# EAGLE board UCirKitBreadboardWithEverythingBottom-08201626 (EAGLE 6.5.0), part 1 of 3
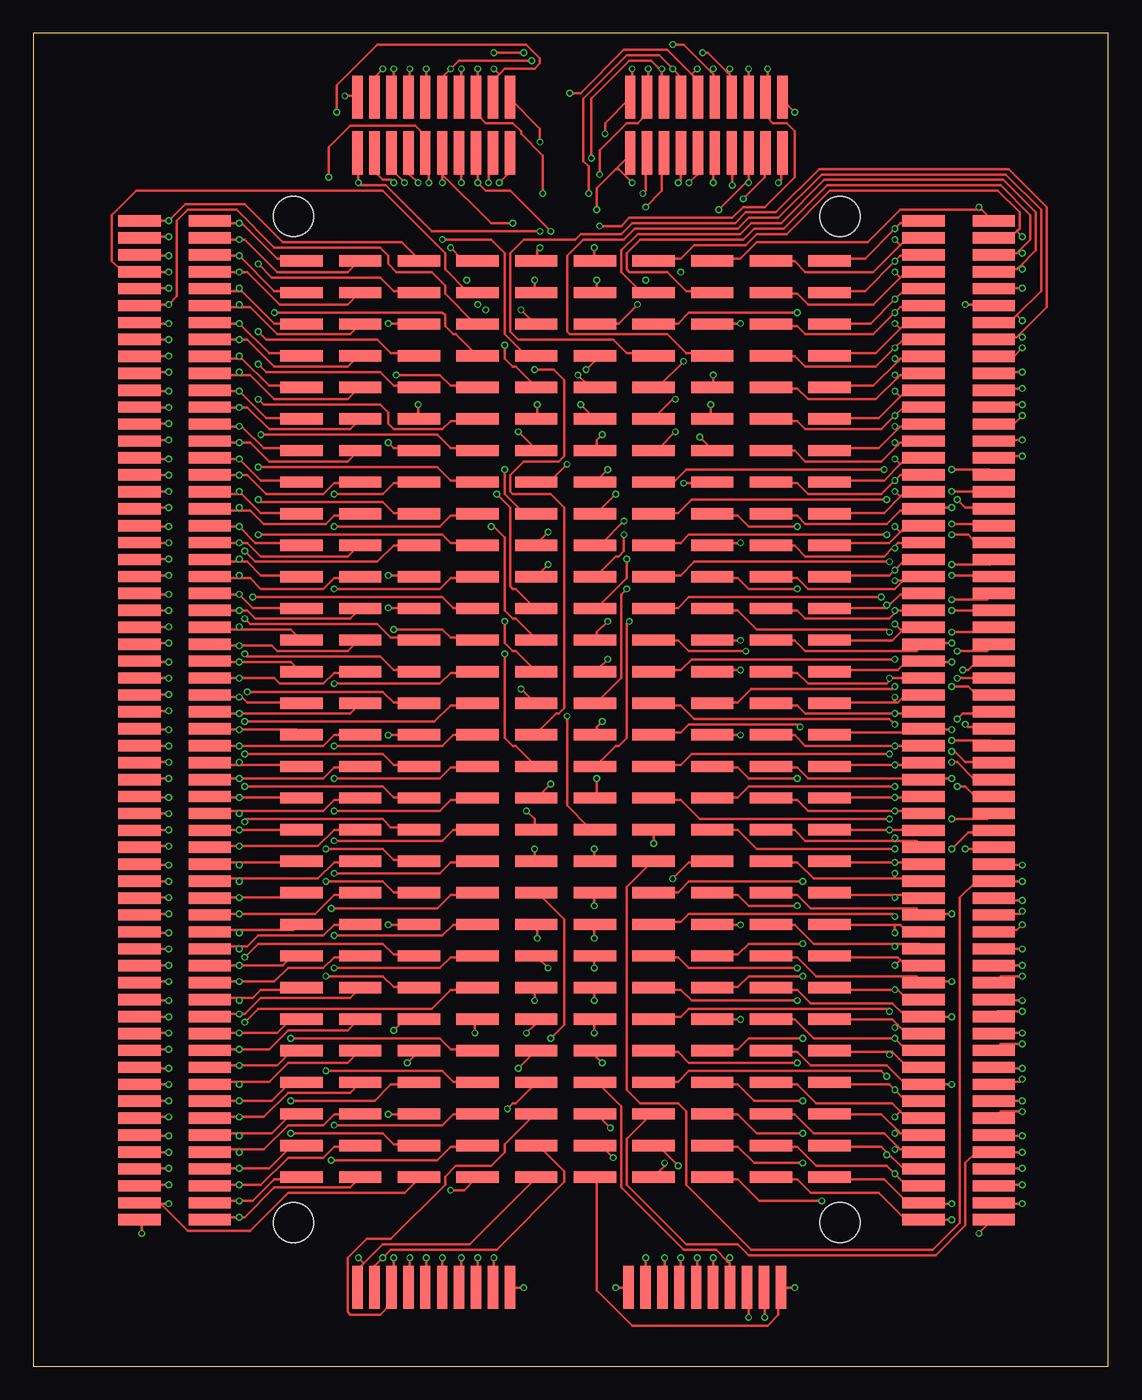
[diagram p5: board, top side]
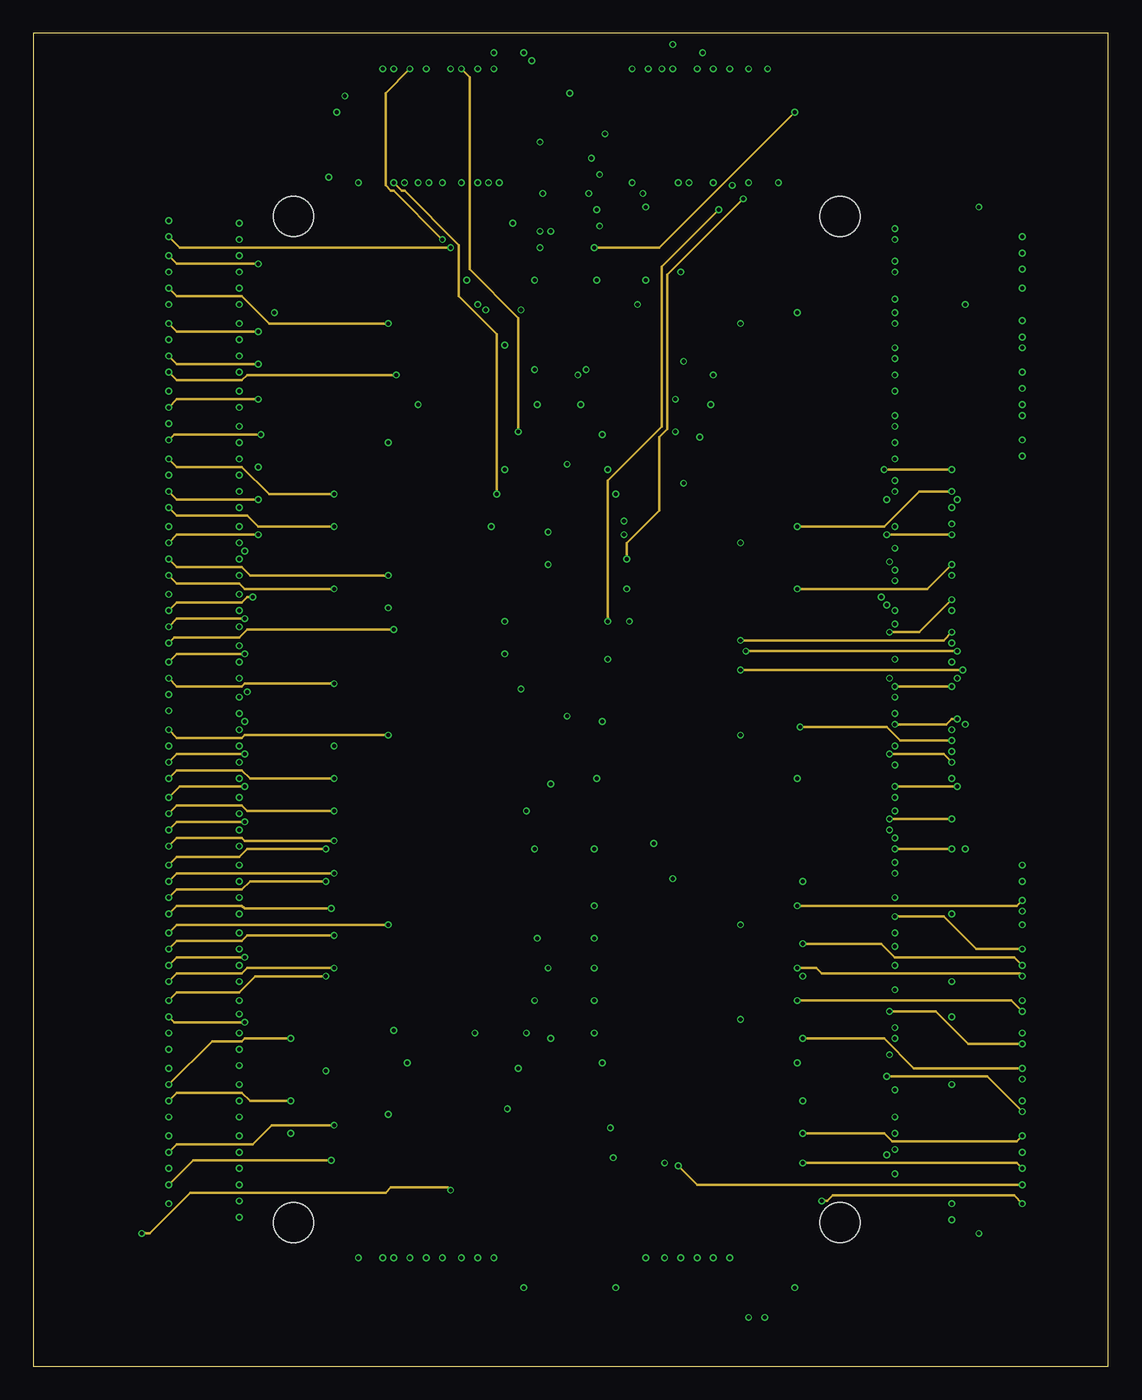
[diagram p6: board, inner layer Route2]
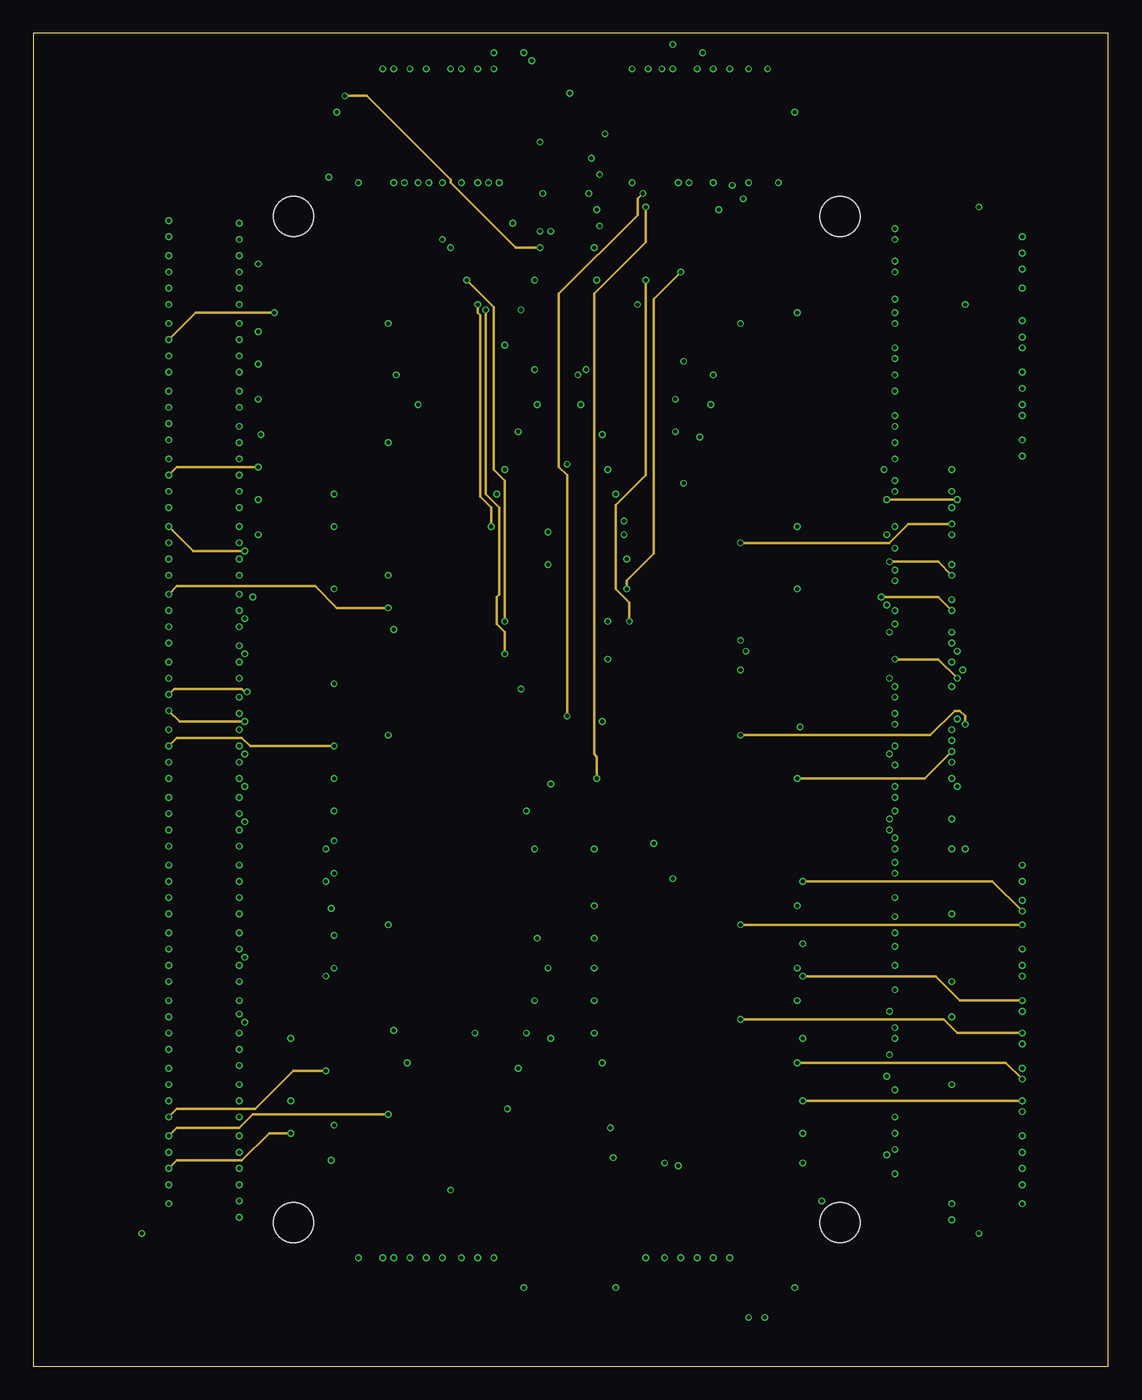
[diagram p7: board, inner layer Route15]
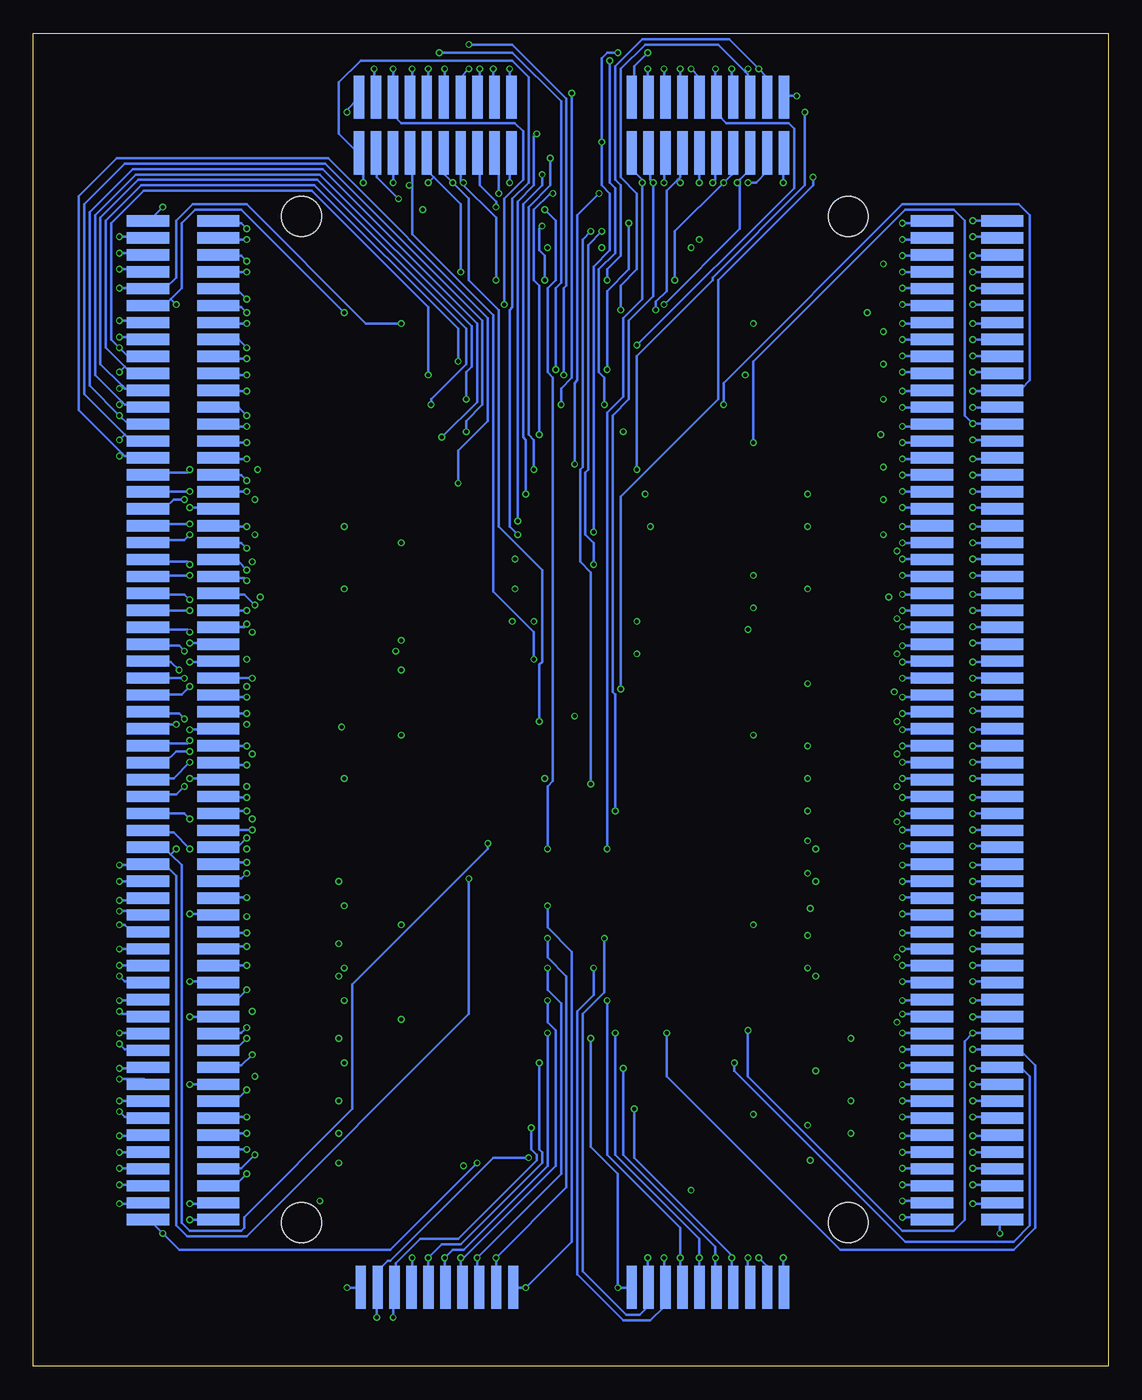
[diagram p8: board, bottom side, seen from below]

Size 80.62 x 100 mm. Coordinates in mm from the lower left corner, seen from the top.
Outline: 0,0 80.62,0 80.62,100 0,100 0,0
Copper layers (1*2*15*16): Top 0.035mm / dielectric 0.2mm / Route2 0.0175mm / dielectric 0.3mm / Route15 0.0175mm / dielectric 0.2mm / Bottom 0.035mm
Design rules "SeeedStudio_4layer_DRU_no_angle_20140221": minimum track width 8mil, minimum drill 12mil, track to track 8mil, track to pad 8mil, pad to pad 8mil, via to via 8mil, smd to smd 0mil, copper to edge 10mil, drill to drill 8mil, minimum pad ring 6mil, minimum via ring 4mil, stop-mask expansion 4mil, vias tented up to drill 100mil, thermal gap 10mil
Holes 3 mm at 19.51,86.27 19.51,10.77 60.51,10.77 60.51,86.27

## Footprints (pad centres in the part's own frame; a part is rotated, then mirrored left to right if it is on the bottom)
1X01_SMD_3.25X0.85MM_NO_SILK = smd 3.25 x 0.85: P$1 0,0

## Placement (x,y rotation side)
JP301  [1X01_SMD_3.25X0.85MM_NO_SILK]  20.11,82.92 0 top
JP302  [1X01_SMD_3.25X0.85MM_NO_SILK]  24.51,82.92 0 top
JP303  [1X01_SMD_3.25X0.85MM_NO_SILK]  28.91,82.92 0 top
JP304  [1X01_SMD_3.25X0.85MM_NO_SILK]  33.31,82.92 0 top
JP305  [1X01_SMD_3.25X0.85MM_NO_SILK]  37.71,82.92 0 top
JP306  [1X01_SMD_3.25X0.85MM_NO_SILK]  42.11,82.92 0 top
JP307  [1X01_SMD_3.25X0.85MM_NO_SILK]  46.51,82.92 0 top
JP308  [1X01_SMD_3.25X0.85MM_NO_SILK]  50.91,82.92 0 top
JP309  [1X01_SMD_3.25X0.85MM_NO_SILK]  55.31,82.92 0 top
JP310  [1X01_SMD_3.25X0.85MM_NO_SILK]  59.71,82.92 0 top
JP311  [1X01_SMD_3.25X0.85MM_NO_SILK]  20.11,80.55 0 top
JP312  [1X01_SMD_3.25X0.85MM_NO_SILK]  24.51,80.55 0 top
JP313  [1X01_SMD_3.25X0.85MM_NO_SILK]  28.91,80.55 0 top
JP314  [1X01_SMD_3.25X0.85MM_NO_SILK]  33.31,80.55 0 top
JP315  [1X01_SMD_3.25X0.85MM_NO_SILK]  37.71,80.55 0 top
JP316  [1X01_SMD_3.25X0.85MM_NO_SILK]  42.11,80.55 0 top
JP317  [1X01_SMD_3.25X0.85MM_NO_SILK]  46.51,80.55 0 top
JP318  [1X01_SMD_3.25X0.85MM_NO_SILK]  50.91,80.55 0 top
JP319  [1X01_SMD_3.25X0.85MM_NO_SILK]  55.31,80.55 0 top
JP320  [1X01_SMD_3.25X0.85MM_NO_SILK]  59.71,80.55 0 top
JP321  [1X01_SMD_3.25X0.85MM_NO_SILK]  20.11,78.18 0 top
JP322  [1X01_SMD_3.25X0.85MM_NO_SILK]  24.51,78.18 0 top
JP323  [1X01_SMD_3.25X0.85MM_NO_SILK]  28.91,78.18 0 top
JP324  [1X01_SMD_3.25X0.85MM_NO_SILK]  33.31,78.18 0 top
JP325  [1X01_SMD_3.25X0.85MM_NO_SILK]  37.71,78.18 0 top
JP326  [1X01_SMD_3.25X0.85MM_NO_SILK]  42.11,78.18 0 top
JP327  [1X01_SMD_3.25X0.85MM_NO_SILK]  46.51,78.18 0 top
JP328  [1X01_SMD_3.25X0.85MM_NO_SILK]  50.91,78.18 0 top
JP329  [1X01_SMD_3.25X0.85MM_NO_SILK]  55.31,78.18 0 top
JP330  [1X01_SMD_3.25X0.85MM_NO_SILK]  59.71,78.18 0 top
JP331  [1X01_SMD_3.25X0.85MM_NO_SILK]  20.11,75.81 0 top
JP332  [1X01_SMD_3.25X0.85MM_NO_SILK]  24.51,75.81 0 top
JP333  [1X01_SMD_3.25X0.85MM_NO_SILK]  28.91,75.81 0 top
JP334  [1X01_SMD_3.25X0.85MM_NO_SILK]  33.31,75.81 0 top
JP335  [1X01_SMD_3.25X0.85MM_NO_SILK]  37.71,75.81 0 top
JP336  [1X01_SMD_3.25X0.85MM_NO_SILK]  42.11,75.81 0 top
JP337  [1X01_SMD_3.25X0.85MM_NO_SILK]  46.51,75.81 0 top
JP338  [1X01_SMD_3.25X0.85MM_NO_SILK]  50.91,75.81 0 top
JP339  [1X01_SMD_3.25X0.85MM_NO_SILK]  55.31,75.81 0 top
JP340  [1X01_SMD_3.25X0.85MM_NO_SILK]  59.71,75.81 0 top
JP341  [1X01_SMD_3.25X0.85MM_NO_SILK]  20.11,73.44 0 top
JP342  [1X01_SMD_3.25X0.85MM_NO_SILK]  24.51,73.44 0 top
JP343  [1X01_SMD_3.25X0.85MM_NO_SILK]  28.91,73.44 0 top
JP344  [1X01_SMD_3.25X0.85MM_NO_SILK]  33.31,73.44 0 top
JP345  [1X01_SMD_3.25X0.85MM_NO_SILK]  37.71,73.44 0 top
JP346  [1X01_SMD_3.25X0.85MM_NO_SILK]  42.11,73.44 0 top
JP347  [1X01_SMD_3.25X0.85MM_NO_SILK]  46.51,73.44 0 top
JP348  [1X01_SMD_3.25X0.85MM_NO_SILK]  50.91,73.44 0 top
JP349  [1X01_SMD_3.25X0.85MM_NO_SILK]  55.31,73.44 0 top
JP350  [1X01_SMD_3.25X0.85MM_NO_SILK]  59.71,73.44 0 top
JP351  [1X01_SMD_3.25X0.85MM_NO_SILK]  20.11,71.07 0 top
JP352  [1X01_SMD_3.25X0.85MM_NO_SILK]  24.51,71.07 0 top
JP353  [1X01_SMD_3.25X0.85MM_NO_SILK]  28.91,71.07 0 top
JP354  [1X01_SMD_3.25X0.85MM_NO_SILK]  33.31,71.07 0 top
JP355  [1X01_SMD_3.25X0.85MM_NO_SILK]  37.71,71.07 0 top
JP356  [1X01_SMD_3.25X0.85MM_NO_SILK]  42.11,71.07 0 top
JP357  [1X01_SMD_3.25X0.85MM_NO_SILK]  46.51,71.07 0 top
JP358  [1X01_SMD_3.25X0.85MM_NO_SILK]  50.91,71.07 0 top
JP359  [1X01_SMD_3.25X0.85MM_NO_SILK]  55.31,71.07 0 top
JP360  [1X01_SMD_3.25X0.85MM_NO_SILK]  59.71,71.07 0 top
JP361  [1X01_SMD_3.25X0.85MM_NO_SILK]  20.11,68.7 0 top
JP362  [1X01_SMD_3.25X0.85MM_NO_SILK]  24.51,68.7 0 top
JP363  [1X01_SMD_3.25X0.85MM_NO_SILK]  28.91,68.7 0 top
JP364  [1X01_SMD_3.25X0.85MM_NO_SILK]  33.31,68.7 0 top
JP365  [1X01_SMD_3.25X0.85MM_NO_SILK]  37.71,68.7 0 top
JP366  [1X01_SMD_3.25X0.85MM_NO_SILK]  42.11,68.7 0 top
JP367  [1X01_SMD_3.25X0.85MM_NO_SILK]  46.51,68.7 0 top
JP368  [1X01_SMD_3.25X0.85MM_NO_SILK]  50.91,68.7 0 top
JP369  [1X01_SMD_3.25X0.85MM_NO_SILK]  55.31,68.7 0 top
JP370  [1X01_SMD_3.25X0.85MM_NO_SILK]  59.71,68.7 0 top
JP371  [1X01_SMD_3.25X0.85MM_NO_SILK]  20.11,66.33 0 top
JP372  [1X01_SMD_3.25X0.85MM_NO_SILK]  24.51,66.33 0 top
JP373  [1X01_SMD_3.25X0.85MM_NO_SILK]  28.91,66.33 0 top
JP374  [1X01_SMD_3.25X0.85MM_NO_SILK]  33.31,66.33 0 top
JP375  [1X01_SMD_3.25X0.85MM_NO_SILK]  37.71,66.33 0 top
JP376  [1X01_SMD_3.25X0.85MM_NO_SILK]  42.11,66.33 0 top
JP377  [1X01_SMD_3.25X0.85MM_NO_SILK]  46.51,66.33 0 top
JP378  [1X01_SMD_3.25X0.85MM_NO_SILK]  50.91,66.33 0 top
JP379  [1X01_SMD_3.25X0.85MM_NO_SILK]  55.31,66.33 0 top
JP380  [1X01_SMD_3.25X0.85MM_NO_SILK]  59.71,66.33 0 top
JP381  [1X01_SMD_3.25X0.85MM_NO_SILK]  20.11,63.96 0 top
JP382  [1X01_SMD_3.25X0.85MM_NO_SILK]  24.51,63.96 0 top
JP383  [1X01_SMD_3.25X0.85MM_NO_SILK]  28.91,63.96 0 top
JP384  [1X01_SMD_3.25X0.85MM_NO_SILK]  33.31,63.96 0 top
JP385  [1X01_SMD_3.25X0.85MM_NO_SILK]  37.71,63.96 0 top
JP386  [1X01_SMD_3.25X0.85MM_NO_SILK]  42.11,63.96 0 top
JP387  [1X01_SMD_3.25X0.85MM_NO_SILK]  46.51,63.96 0 top
JP388  [1X01_SMD_3.25X0.85MM_NO_SILK]  50.91,63.96 0 top
JP389  [1X01_SMD_3.25X0.85MM_NO_SILK]  55.31,63.96 0 top
JP390  [1X01_SMD_3.25X0.85MM_NO_SILK]  59.71,63.96 0 top
JP391  [1X01_SMD_3.25X0.85MM_NO_SILK]  20.11,61.59 0 top
JP392  [1X01_SMD_3.25X0.85MM_NO_SILK]  24.51,61.59 0 top
JP393  [1X01_SMD_3.25X0.85MM_NO_SILK]  28.91,61.59 0 top
JP394  [1X01_SMD_3.25X0.85MM_NO_SILK]  33.31,61.59 0 top
JP395  [1X01_SMD_3.25X0.85MM_NO_SILK]  37.71,61.59 0 top
JP396  [1X01_SMD_3.25X0.85MM_NO_SILK]  42.11,61.59 0 top
JP397  [1X01_SMD_3.25X0.85MM_NO_SILK]  46.51,61.59 0 top
JP398  [1X01_SMD_3.25X0.85MM_NO_SILK]  50.91,61.59 0 top
JP399  [1X01_SMD_3.25X0.85MM_NO_SILK]  55.31,61.59 0 top
JP400  [1X01_SMD_3.25X0.85MM_NO_SILK]  59.71,61.59 0 top
JP401  [1X01_SMD_3.25X0.85MM_NO_SILK]  20.11,59.22 0 top
JP402  [1X01_SMD_3.25X0.85MM_NO_SILK]  24.51,59.22 0 top
JP403  [1X01_SMD_3.25X0.85MM_NO_SILK]  28.91,59.22 0 top
JP404  [1X01_SMD_3.25X0.85MM_NO_SILK]  33.31,59.22 0 top
JP405  [1X01_SMD_3.25X0.85MM_NO_SILK]  37.71,59.22 0 top
JP406  [1X01_SMD_3.25X0.85MM_NO_SILK]  42.11,59.22 0 top
JP407  [1X01_SMD_3.25X0.85MM_NO_SILK]  46.51,59.22 0 top
JP408  [1X01_SMD_3.25X0.85MM_NO_SILK]  50.91,59.22 0 top
JP409  [1X01_SMD_3.25X0.85MM_NO_SILK]  55.31,59.22 0 top
JP410  [1X01_SMD_3.25X0.85MM_NO_SILK]  59.71,59.22 0 top
JP411  [1X01_SMD_3.25X0.85MM_NO_SILK]  20.11,56.85 0 top
JP412  [1X01_SMD_3.25X0.85MM_NO_SILK]  24.51,56.85 0 top
JP413  [1X01_SMD_3.25X0.85MM_NO_SILK]  28.91,56.85 0 top
JP414  [1X01_SMD_3.25X0.85MM_NO_SILK]  33.31,56.85 0 top
JP415  [1X01_SMD_3.25X0.85MM_NO_SILK]  37.71,56.85 0 top
JP416  [1X01_SMD_3.25X0.85MM_NO_SILK]  42.11,56.85 0 top
JP417  [1X01_SMD_3.25X0.85MM_NO_SILK]  46.51,56.85 0 top
JP418  [1X01_SMD_3.25X0.85MM_NO_SILK]  50.91,56.85 0 top
JP419  [1X01_SMD_3.25X0.85MM_NO_SILK]  55.31,56.85 0 top
JP420  [1X01_SMD_3.25X0.85MM_NO_SILK]  59.71,56.85 0 top
JP421  [1X01_SMD_3.25X0.85MM_NO_SILK]  20.11,54.48 0 top
JP422  [1X01_SMD_3.25X0.85MM_NO_SILK]  24.51,54.48 0 top
JP423  [1X01_SMD_3.25X0.85MM_NO_SILK]  28.91,54.48 0 top
JP424  [1X01_SMD_3.25X0.85MM_NO_SILK]  33.31,54.48 0 top
JP425  [1X01_SMD_3.25X0.85MM_NO_SILK]  37.71,54.48 0 top
JP426  [1X01_SMD_3.25X0.85MM_NO_SILK]  42.11,54.48 0 top
JP427  [1X01_SMD_3.25X0.85MM_NO_SILK]  46.51,54.48 0 top
JP428  [1X01_SMD_3.25X0.85MM_NO_SILK]  50.91,54.48 0 top
JP429  [1X01_SMD_3.25X0.85MM_NO_SILK]  55.31,54.48 0 top
JP430  [1X01_SMD_3.25X0.85MM_NO_SILK]  59.71,54.48 0 top
JP431  [1X01_SMD_3.25X0.85MM_NO_SILK]  20.11,52.11 0 top
JP432  [1X01_SMD_3.25X0.85MM_NO_SILK]  24.51,52.11 0 top
JP433  [1X01_SMD_3.25X0.85MM_NO_SILK]  28.91,52.11 0 top
JP434  [1X01_SMD_3.25X0.85MM_NO_SILK]  33.31,52.11 0 top
JP435  [1X01_SMD_3.25X0.85MM_NO_SILK]  37.71,52.11 0 top
JP436  [1X01_SMD_3.25X0.85MM_NO_SILK]  42.11,52.11 0 top
JP437  [1X01_SMD_3.25X0.85MM_NO_SILK]  46.51,52.11 0 top
JP438  [1X01_SMD_3.25X0.85MM_NO_SILK]  50.91,52.11 0 top
JP439  [1X01_SMD_3.25X0.85MM_NO_SILK]  55.31,52.11 0 top
JP440  [1X01_SMD_3.25X0.85MM_NO_SILK]  59.71,52.11 0 top
JP441  [1X01_SMD_3.25X0.85MM_NO_SILK]  20.11,49.74 0 top
JP442  [1X01_SMD_3.25X0.85MM_NO_SILK]  24.51,49.74 0 top
JP443  [1X01_SMD_3.25X0.85MM_NO_SILK]  28.91,49.74 0 top
JP444  [1X01_SMD_3.25X0.85MM_NO_SILK]  33.31,49.74 0 top
JP445  [1X01_SMD_3.25X0.85MM_NO_SILK]  37.71,49.74 0 top
JP446  [1X01_SMD_3.25X0.85MM_NO_SILK]  42.11,49.74 0 top
JP447  [1X01_SMD_3.25X0.85MM_NO_SILK]  46.51,49.74 0 top
JP448  [1X01_SMD_3.25X0.85MM_NO_SILK]  50.91,49.74 0 top
JP449  [1X01_SMD_3.25X0.85MM_NO_SILK]  55.31,49.74 0 top
JP450  [1X01_SMD_3.25X0.85MM_NO_SILK]  59.71,49.74 0 top
JP451  [1X01_SMD_3.25X0.85MM_NO_SILK]  20.11,47.37 0 top
JP452  [1X01_SMD_3.25X0.85MM_NO_SILK]  24.51,47.37 0 top
JP453  [1X01_SMD_3.25X0.85MM_NO_SILK]  28.91,47.37 0 top
JP454  [1X01_SMD_3.25X0.85MM_NO_SILK]  33.31,47.37 0 top
JP455  [1X01_SMD_3.25X0.85MM_NO_SILK]  37.71,47.37 0 top
JP456  [1X01_SMD_3.25X0.85MM_NO_SILK]  42.11,47.37 0 top
JP457  [1X01_SMD_3.25X0.85MM_NO_SILK]  46.51,47.37 0 top
JP458  [1X01_SMD_3.25X0.85MM_NO_SILK]  50.91,47.37 0 top
JP459  [1X01_SMD_3.25X0.85MM_NO_SILK]  55.31,47.37 0 top
JP460  [1X01_SMD_3.25X0.85MM_NO_SILK]  59.71,47.37 0 top
JP461  [1X01_SMD_3.25X0.85MM_NO_SILK]  20.11,45 0 top
JP462  [1X01_SMD_3.25X0.85MM_NO_SILK]  24.51,45 0 top
JP463  [1X01_SMD_3.25X0.85MM_NO_SILK]  28.91,45 0 top
JP464  [1X01_SMD_3.25X0.85MM_NO_SILK]  33.31,45 0 top
JP465  [1X01_SMD_3.25X0.85MM_NO_SILK]  37.71,45 0 top
JP466  [1X01_SMD_3.25X0.85MM_NO_SILK]  42.11,45 0 top
JP467  [1X01_SMD_3.25X0.85MM_NO_SILK]  46.51,45 0 top
JP468  [1X01_SMD_3.25X0.85MM_NO_SILK]  50.91,45 0 top
JP469  [1X01_SMD_3.25X0.85MM_NO_SILK]  55.31,45 0 top
JP470  [1X01_SMD_3.25X0.85MM_NO_SILK]  59.71,45 0 top
JP471  [1X01_SMD_3.25X0.85MM_NO_SILK]  20.11,42.63 0 top
JP472  [1X01_SMD_3.25X0.85MM_NO_SILK]  24.51,42.63 0 top
JP473  [1X01_SMD_3.25X0.85MM_NO_SILK]  28.91,42.63 0 top
JP474  [1X01_SMD_3.25X0.85MM_NO_SILK]  33.31,42.63 0 top
JP475  [1X01_SMD_3.25X0.85MM_NO_SILK]  37.71,42.63 0 top
JP476  [1X01_SMD_3.25X0.85MM_NO_SILK]  42.11,42.63 0 top
JP477  [1X01_SMD_3.25X0.85MM_NO_SILK]  46.51,42.63 0 top
JP478  [1X01_SMD_3.25X0.85MM_NO_SILK]  50.91,42.63 0 top
JP479  [1X01_SMD_3.25X0.85MM_NO_SILK]  55.31,42.63 0 top
JP480  [1X01_SMD_3.25X0.85MM_NO_SILK]  59.71,42.63 0 top
JP481  [1X01_SMD_3.25X0.85MM_NO_SILK]  20.11,40.26 0 top
JP482  [1X01_SMD_3.25X0.85MM_NO_SILK]  24.51,40.26 0 top
JP483  [1X01_SMD_3.25X0.85MM_NO_SILK]  28.91,40.26 0 top
JP484  [1X01_SMD_3.25X0.85MM_NO_SILK]  33.31,40.26 0 top
JP485  [1X01_SMD_3.25X0.85MM_NO_SILK]  37.71,40.26 0 top
JP486  [1X01_SMD_3.25X0.85MM_NO_SILK]  42.11,40.26 0 top
JP487  [1X01_SMD_3.25X0.85MM_NO_SILK]  46.51,40.26 0 top
JP488  [1X01_SMD_3.25X0.85MM_NO_SILK]  50.91,40.26 0 top
JP489  [1X01_SMD_3.25X0.85MM_NO_SILK]  55.31,40.26 0 top
JP490  [1X01_SMD_3.25X0.85MM_NO_SILK]  59.71,40.26 0 top
JP491  [1X01_SMD_3.25X0.85MM_NO_SILK]  20.11,37.89 0 top
JP492  [1X01_SMD_3.25X0.85MM_NO_SILK]  24.51,37.89 0 top
JP493  [1X01_SMD_3.25X0.85MM_NO_SILK]  28.91,37.89 0 top
JP494  [1X01_SMD_3.25X0.85MM_NO_SILK]  33.31,37.89 0 top
JP495  [1X01_SMD_3.25X0.85MM_NO_SILK]  37.71,37.89 0 top
JP496  [1X01_SMD_3.25X0.85MM_NO_SILK]  42.11,37.89 0 top
JP497  [1X01_SMD_3.25X0.85MM_NO_SILK]  46.51,37.89 0 top
JP498  [1X01_SMD_3.25X0.85MM_NO_SILK]  50.91,37.89 0 top
JP499  [1X01_SMD_3.25X0.85MM_NO_SILK]  55.31,37.89 0 top
JP500  [1X01_SMD_3.25X0.85MM_NO_SILK]  59.71,37.89 0 top
JP501  [1X01_SMD_3.25X0.85MM_NO_SILK]  20.11,35.52 0 top
JP502  [1X01_SMD_3.25X0.85MM_NO_SILK]  24.51,35.52 0 top
JP503  [1X01_SMD_3.25X0.85MM_NO_SILK]  28.91,35.52 0 top
JP504  [1X01_SMD_3.25X0.85MM_NO_SILK]  33.31,35.52 0 top
JP505  [1X01_SMD_3.25X0.85MM_NO_SILK]  37.71,35.52 0 top
JP506  [1X01_SMD_3.25X0.85MM_NO_SILK]  42.11,35.52 0 top
JP507  [1X01_SMD_3.25X0.85MM_NO_SILK]  46.51,35.52 0 top
JP508  [1X01_SMD_3.25X0.85MM_NO_SILK]  50.91,35.52 0 top
JP509  [1X01_SMD_3.25X0.85MM_NO_SILK]  55.31,35.52 0 top
JP510  [1X01_SMD_3.25X0.85MM_NO_SILK]  59.71,35.52 0 top
JP511  [1X01_SMD_3.25X0.85MM_NO_SILK]  20.11,33.15 0 top
JP512  [1X01_SMD_3.25X0.85MM_NO_SILK]  24.51,33.15 0 top
JP513  [1X01_SMD_3.25X0.85MM_NO_SILK]  28.91,33.15 0 top
JP514  [1X01_SMD_3.25X0.85MM_NO_SILK]  33.31,33.15 0 top
JP515  [1X01_SMD_3.25X0.85MM_NO_SILK]  37.71,33.15 0 top
JP516  [1X01_SMD_3.25X0.85MM_NO_SILK]  42.11,33.15 0 top
JP517  [1X01_SMD_3.25X0.85MM_NO_SILK]  46.51,33.15 0 top
JP518  [1X01_SMD_3.25X0.85MM_NO_SILK]  50.91,33.15 0 top
JP519  [1X01_SMD_3.25X0.85MM_NO_SILK]  55.31,33.15 0 top
JP520  [1X01_SMD_3.25X0.85MM_NO_SILK]  59.71,33.15 0 top
JP521  [1X01_SMD_3.25X0.85MM_NO_SILK]  20.11,30.78 0 top
JP522  [1X01_SMD_3.25X0.85MM_NO_SILK]  24.51,30.78 0 top
JP523  [1X01_SMD_3.25X0.85MM_NO_SILK]  28.91,30.78 0 top
JP524  [1X01_SMD_3.25X0.85MM_NO_SILK]  33.31,30.78 0 top
JP525  [1X01_SMD_3.25X0.85MM_NO_SILK]  37.71,30.78 0 top
JP526  [1X01_SMD_3.25X0.85MM_NO_SILK]  42.11,30.78 0 top
JP527  [1X01_SMD_3.25X0.85MM_NO_SILK]  46.51,30.78 0 top
JP528  [1X01_SMD_3.25X0.85MM_NO_SILK]  50.91,30.78 0 top
JP529  [1X01_SMD_3.25X0.85MM_NO_SILK]  55.31,30.78 0 top
JP530  [1X01_SMD_3.25X0.85MM_NO_SILK]  59.71,30.78 0 top
JP531  [1X01_SMD_3.25X0.85MM_NO_SILK]  20.11,28.41 0 top
JP532  [1X01_SMD_3.25X0.85MM_NO_SILK]  24.51,28.41 0 top
JP533  [1X01_SMD_3.25X0.85MM_NO_SILK]  28.91,28.41 0 top
JP534  [1X01_SMD_3.25X0.85MM_NO_SILK]  33.31,28.41 0 top
JP535  [1X01_SMD_3.25X0.85MM_NO_SILK]  37.71,28.41 0 top
JP536  [1X01_SMD_3.25X0.85MM_NO_SILK]  42.11,28.41 0 top
JP537  [1X01_SMD_3.25X0.85MM_NO_SILK]  46.51,28.41 0 top
JP538  [1X01_SMD_3.25X0.85MM_NO_SILK]  50.91,28.41 0 top
JP539  [1X01_SMD_3.25X0.85MM_NO_SILK]  55.31,28.41 0 top
JP540  [1X01_SMD_3.25X0.85MM_NO_SILK]  59.71,28.41 0 top
JP541  [1X01_SMD_3.25X0.85MM_NO_SILK]  20.11,26.04 0 top
JP542  [1X01_SMD_3.25X0.85MM_NO_SILK]  24.51,26.04 0 top
JP543  [1X01_SMD_3.25X0.85MM_NO_SILK]  28.91,26.04 0 top
JP544  [1X01_SMD_3.25X0.85MM_NO_SILK]  33.31,26.04 0 top
JP545  [1X01_SMD_3.25X0.85MM_NO_SILK]  37.71,26.04 0 top
JP546  [1X01_SMD_3.25X0.85MM_NO_SILK]  42.11,26.04 0 top
JP547  [1X01_SMD_3.25X0.85MM_NO_SILK]  46.51,26.04 0 top
JP548  [1X01_SMD_3.25X0.85MM_NO_SILK]  50.91,26.04 0 top
JP549  [1X01_SMD_3.25X0.85MM_NO_SILK]  55.31,26.04 0 top
JP550  [1X01_SMD_3.25X0.85MM_NO_SILK]  59.71,26.04 0 top
JP551  [1X01_SMD_3.25X0.85MM_NO_SILK]  20.11,23.67 0 top
JP552  [1X01_SMD_3.25X0.85MM_NO_SILK]  24.51,23.67 0 top
JP553  [1X01_SMD_3.25X0.85MM_NO_SILK]  28.91,23.67 0 top
JP554  [1X01_SMD_3.25X0.85MM_NO_SILK]  33.31,23.67 0 top
JP555  [1X01_SMD_3.25X0.85MM_NO_SILK]  37.71,23.67 0 top
JP556  [1X01_SMD_3.25X0.85MM_NO_SILK]  42.11,23.67 0 top
JP557  [1X01_SMD_3.25X0.85MM_NO_SILK]  46.51,23.67 0 top
JP558  [1X01_SMD_3.25X0.85MM_NO_SILK]  50.91,23.67 0 top
JP559  [1X01_SMD_3.25X0.85MM_NO_SILK]  55.31,23.67 0 top
JP560  [1X01_SMD_3.25X0.85MM_NO_SILK]  59.71,23.67 0 top
JP561  [1X01_SMD_3.25X0.85MM_NO_SILK]  20.11,21.3 0 top
JP562  [1X01_SMD_3.25X0.85MM_NO_SILK]  24.51,21.3 0 top
JP563  [1X01_SMD_3.25X0.85MM_NO_SILK]  28.91,21.3 0 top
JP564  [1X01_SMD_3.25X0.85MM_NO_SILK]  33.31,21.3 0 top
JP565  [1X01_SMD_3.25X0.85MM_NO_SILK]  37.71,21.3 0 top
JP566  [1X01_SMD_3.25X0.85MM_NO_SILK]  42.11,21.3 0 top
JP567  [1X01_SMD_3.25X0.85MM_NO_SILK]  46.51,21.3 0 top
JP568  [1X01_SMD_3.25X0.85MM_NO_SILK]  50.91,21.3 0 top
JP569  [1X01_SMD_3.25X0.85MM_NO_SILK]  55.31,21.3 0 top
JP570  [1X01_SMD_3.25X0.85MM_NO_SILK]  59.71,21.3 0 top
JP571  [1X01_SMD_3.25X0.85MM_NO_SILK]  20.11,18.93 0 top
JP572  [1X01_SMD_3.25X0.85MM_NO_SILK]  24.51,18.93 0 top
JP573  [1X01_SMD_3.25X0.85MM_NO_SILK]  28.91,18.93 0 top
JP574  [1X01_SMD_3.25X0.85MM_NO_SILK]  33.31,18.93 0 top
JP575  [1X01_SMD_3.25X0.85MM_NO_SILK]  37.71,18.93 0 top
JP576  [1X01_SMD_3.25X0.85MM_NO_SILK]  42.11,18.93 0 top
JP577  [1X01_SMD_3.25X0.85MM_NO_SILK]  46.51,18.93 0 top
JP578  [1X01_SMD_3.25X0.85MM_NO_SILK]  50.91,18.93 0 top
JP579  [1X01_SMD_3.25X0.85MM_NO_SILK]  55.31,18.93 0 top
JP580  [1X01_SMD_3.25X0.85MM_NO_SILK]  59.71,18.93 0 top
JP581  [1X01_SMD_3.25X0.85MM_NO_SILK]  20.11,16.56 0 top
JP582  [1X01_SMD_3.25X0.85MM_NO_SILK]  24.51,16.56 0 top
JP583  [1X01_SMD_3.25X0.85MM_NO_SILK]  28.91,16.56 0 top
JP584  [1X01_SMD_3.25X0.85MM_NO_SILK]  33.31,16.56 0 top
JP585  [1X01_SMD_3.25X0.85MM_NO_SILK]  37.71,16.56 0 top
JP586  [1X01_SMD_3.25X0.85MM_NO_SILK]  42.11,16.56 0 top
JP587  [1X01_SMD_3.25X0.85MM_NO_SILK]  46.51,16.56 0 top
JP588  [1X01_SMD_3.25X0.85MM_NO_SILK]  50.91,16.56 0 top
JP589  [1X01_SMD_3.25X0.85MM_NO_SILK]  55.31,16.56 0 top
JP590  [1X01_SMD_3.25X0.85MM_NO_SILK]  59.71,16.56 0 top
JP591  [1X01_SMD_3.25X0.85MM_NO_SILK]  20.11,14.19 0 top
JP592  [1X01_SMD_3.25X0.85MM_NO_SILK]  24.51,14.19 0 top
JP593  [1X01_SMD_3.25X0.85MM_NO_SILK]  28.91,14.19 0 top
JP594  [1X01_SMD_3.25X0.85MM_NO_SILK]  33.31,14.19 0 top
JP595  [1X01_SMD_3.25X0.85MM_NO_SILK]  37.71,14.19 0 top
JP596  [1X01_SMD_3.25X0.85MM_NO_SILK]  42.11,14.19 0 top
JP597  [1X01_SMD_3.25X0.85MM_NO_SILK]  46.51,14.19 0 top
JP598  [1X01_SMD_3.25X0.85MM_NO_SILK]  50.91,14.19 0 top
JP599  [1X01_SMD_3.25X0.85MM_NO_SILK]  55.31,14.19 0 top
JP600  [1X01_SMD_3.25X0.85MM_NO_SILK]  59.71,14.19 0 top
JP601  [1X01_SMD_3.25X0.85MM_NO_SILK]  7.96,85.92 0 top
JP602  [1X01_SMD_3.25X0.85MM_NO_SILK]  7.96,84.65 0 top
JP603  [1X01_SMD_3.25X0.85MM_NO_SILK]  7.96,83.38 0 top
JP604  [1X01_SMD_3.25X0.85MM_NO_SILK]  7.96,82.11 0 top
JP605  [1X01_SMD_3.25X0.85MM_NO_SILK]  7.96,80.84 0 top
JP606  [1X01_SMD_3.25X0.85MM_NO_SILK]  7.96,79.57 0 top
JP607  [1X01_SMD_3.25X0.85MM_NO_SILK]  7.96,78.3 0 top
JP608  [1X01_SMD_3.25X0.85MM_NO_SILK]  7.96,77.03 0 top
JP609  [1X01_SMD_3.25X0.85MM_NO_SILK]  7.96,75.76 0 top
JP610  [1X01_SMD_3.25X0.85MM_NO_SILK]  7.96,74.49 0 top
JP611  [1X01_SMD_3.25X0.85MM_NO_SILK]  7.96,73.22 0 top
JP612  [1X01_SMD_3.25X0.85MM_NO_SILK]  7.96,71.95 0 top
JP613  [1X01_SMD_3.25X0.85MM_NO_SILK]  7.96,70.68 0 top
JP614  [1X01_SMD_3.25X0.85MM_NO_SILK]  7.96,69.41 0 top
JP615  [1X01_SMD_3.25X0.85MM_NO_SILK]  7.96,68.14 0 top
JP616  [1X01_SMD_3.25X0.85MM_NO_SILK]  7.96,66.87 0 top
JP617  [1X01_SMD_3.25X0.85MM_NO_SILK]  7.96,65.6 0 top
JP618  [1X01_SMD_3.25X0.85MM_NO_SILK]  7.96,64.33 0 top
JP619  [1X01_SMD_3.25X0.85MM_NO_SILK]  7.96,63.06 0 top
JP620  [1X01_SMD_3.25X0.85MM_NO_SILK]  7.96,61.79 0 top
JP621  [1X01_SMD_3.25X0.85MM_NO_SILK]  7.96,60.52 0 top
JP622  [1X01_SMD_3.25X0.85MM_NO_SILK]  7.96,59.25 0 top
JP623  [1X01_SMD_3.25X0.85MM_NO_SILK]  7.96,57.98 0 top
JP624  [1X01_SMD_3.25X0.85MM_NO_SILK]  7.96,56.71 0 top
JP625  [1X01_SMD_3.25X0.85MM_NO_SILK]  7.96,55.44 0 top
JP626  [1X01_SMD_3.25X0.85MM_NO_SILK]  7.96,54.17 0 top
JP627  [1X01_SMD_3.25X0.85MM_NO_SILK]  7.96,52.9 0 top
JP628  [1X01_SMD_3.25X0.85MM_NO_SILK]  7.96,51.63 0 top
JP629  [1X01_SMD_3.25X0.85MM_NO_SILK]  7.96,50.36 0 top
JP630  [1X01_SMD_3.25X0.85MM_NO_SILK]  7.96,49.09 0 top
JP631  [1X01_SMD_3.25X0.85MM_NO_SILK]  7.96,47.82 0 top
JP632  [1X01_SMD_3.25X0.85MM_NO_SILK]  7.96,46.55 0 top
JP633  [1X01_SMD_3.25X0.85MM_NO_SILK]  7.96,45.28 0 top
JP634  [1X01_SMD_3.25X0.85MM_NO_SILK]  7.96,44.01 0 top
JP635  [1X01_SMD_3.25X0.85MM_NO_SILK]  7.96,42.74 0 top
JP636  [1X01_SMD_3.25X0.85MM_NO_SILK]  7.96,41.47 0 top
JP637  [1X01_SMD_3.25X0.85MM_NO_SILK]  7.96,40.2 0 top
JP638  [1X01_SMD_3.25X0.85MM_NO_SILK]  7.96,38.93 0 top
JP639  [1X01_SMD_3.25X0.85MM_NO_SILK]  7.96,37.66 0 top
JP640  [1X01_SMD_3.25X0.85MM_NO_SILK]  7.96,36.39 0 top
JP641  [1X01_SMD_3.25X0.85MM_NO_SILK]  7.96,35.12 0 top
JP642  [1X01_SMD_3.25X0.85MM_NO_SILK]  7.96,33.85 0 top
JP643  [1X01_SMD_3.25X0.85MM_NO_SILK]  7.96,32.58 0 top
JP644  [1X01_SMD_3.25X0.85MM_NO_SILK]  7.96,31.31 0 top
JP645  [1X01_SMD_3.25X0.85MM_NO_SILK]  7.96,30.04 0 top
JP646  [1X01_SMD_3.25X0.85MM_NO_SILK]  7.96,28.77 0 top
JP647  [1X01_SMD_3.25X0.85MM_NO_SILK]  7.96,27.5 0 top
JP648  [1X01_SMD_3.25X0.85MM_NO_SILK]  7.96,26.23 0 top
JP649  [1X01_SMD_3.25X0.85MM_NO_SILK]  7.96,24.96 0 top
JP650  [1X01_SMD_3.25X0.85MM_NO_SILK]  7.96,23.69 0 top
JP651  [1X01_SMD_3.25X0.85MM_NO_SILK]  7.96,22.42 0 top
JP652  [1X01_SMD_3.25X0.85MM_NO_SILK]  7.96,21.15 0 top
JP653  [1X01_SMD_3.25X0.85MM_NO_SILK]  7.96,19.88 0 top
JP654  [1X01_SMD_3.25X0.85MM_NO_SILK]  7.96,18.61 0 top
JP655  [1X01_SMD_3.25X0.85MM_NO_SILK]  7.96,17.34 0 top
JP656  [1X01_SMD_3.25X0.85MM_NO_SILK]  7.96,16.07 0 top
JP657  [1X01_SMD_3.25X0.85MM_NO_SILK]  7.96,14.8 0 top
JP658  [1X01_SMD_3.25X0.85MM_NO_SILK]  7.96,13.53 0 top
JP659  [1X01_SMD_3.25X0.85MM_NO_SILK]  7.96,12.26 0 top
JP660  [1X01_SMD_3.25X0.85MM_NO_SILK]  7.96,10.99 0 top
JP661  [1X01_SMD_3.25X0.85MM_NO_SILK]  13.23,85.92 0 top
JP662  [1X01_SMD_3.25X0.85MM_NO_SILK]  13.23,84.65 0 top
JP663  [1X01_SMD_3.25X0.85MM_NO_SILK]  13.23,83.38 0 top
JP664  [1X01_SMD_3.25X0.85MM_NO_SILK]  13.23,82.11 0 top
JP665  [1X01_SMD_3.25X0.85MM_NO_SILK]  13.23,80.84 0 top
JP666  [1X01_SMD_3.25X0.85MM_NO_SILK]  13.23,79.57 0 top
JP667  [1X01_SMD_3.25X0.85MM_NO_SILK]  13.23,78.3 0 top
JP668  [1X01_SMD_3.25X0.85MM_NO_SILK]  13.23,77.03 0 top
JP669  [1X01_SMD_3.25X0.85MM_NO_SILK]  13.23,75.76 0 top
JP670  [1X01_SMD_3.25X0.85MM_NO_SILK]  13.23,74.49 0 top
JP671  [1X01_SMD_3.25X0.85MM_NO_SILK]  13.23,73.22 0 top
JP672  [1X01_SMD_3.25X0.85MM_NO_SILK]  13.23,71.95 0 top
JP673  [1X01_SMD_3.25X0.85MM_NO_SILK]  13.23,70.68 0 top
JP674  [1X01_SMD_3.25X0.85MM_NO_SILK]  13.23,69.41 0 top
JP675  [1X01_SMD_3.25X0.85MM_NO_SILK]  13.23,68.14 0 top
JP676  [1X01_SMD_3.25X0.85MM_NO_SILK]  13.23,66.87 0 top
JP677  [1X01_SMD_3.25X0.85MM_NO_SILK]  13.23,65.6 0 top
JP678  [1X01_SMD_3.25X0.85MM_NO_SILK]  13.23,64.33 0 top
JP679  [1X01_SMD_3.25X0.85MM_NO_SILK]  13.23,63.06 0 top
JP680  [1X01_SMD_3.25X0.85MM_NO_SILK]  13.23,61.79 0 top
JP681  [1X01_SMD_3.25X0.85MM_NO_SILK]  13.23,60.52 0 top
JP682  [1X01_SMD_3.25X0.85MM_NO_SILK]  13.23,59.25 0 top
JP683  [1X01_SMD_3.25X0.85MM_NO_SILK]  13.23,57.98 0 top
JP684  [1X01_SMD_3.25X0.85MM_NO_SILK]  13.23,56.71 0 top
JP685  [1X01_SMD_3.25X0.85MM_NO_SILK]  13.23,55.44 0 top
JP686  [1X01_SMD_3.25X0.85MM_NO_SILK]  13.23,54.17 0 top
JP687  [1X01_SMD_3.25X0.85MM_NO_SILK]  13.23,52.9 0 top
JP688  [1X01_SMD_3.25X0.85MM_NO_SILK]  13.23,51.63 0 top
JP689  [1X01_SMD_3.25X0.85MM_NO_SILK]  13.23,50.36 0 top
JP690  [1X01_SMD_3.25X0.85MM_NO_SILK]  13.23,49.09 0 top
JP691  [1X01_SMD_3.25X0.85MM_NO_SILK]  13.23,47.82 0 top
JP692  [1X01_SMD_3.25X0.85MM_NO_SILK]  13.23,46.55 0 top
JP693  [1X01_SMD_3.25X0.85MM_NO_SILK]  13.23,45.28 0 top
JP694  [1X01_SMD_3.25X0.85MM_NO_SILK]  13.23,44.01 0 top
JP695  [1X01_SMD_3.25X0.85MM_NO_SILK]  13.23,42.74 0 top
JP696  [1X01_SMD_3.25X0.85MM_NO_SILK]  13.23,41.47 0 top
JP697  [1X01_SMD_3.25X0.85MM_NO_SILK]  13.23,40.2 0 top
JP698  [1X01_SMD_3.25X0.85MM_NO_SILK]  13.23,38.93 0 top
JP699  [1X01_SMD_3.25X0.85MM_NO_SILK]  13.23,37.66 0 top
JP700  [1X01_SMD_3.25X0.85MM_NO_SILK]  13.23,36.39 0 top
JP701  [1X01_SMD_3.25X0.85MM_NO_SILK]  13.23,35.12 0 top
JP702  [1X01_SMD_3.25X0.85MM_NO_SILK]  13.23,33.85 0 top
JP703  [1X01_SMD_3.25X0.85MM_NO_SILK]  13.23,32.58 0 top
JP704  [1X01_SMD_3.25X0.85MM_NO_SILK]  13.23,31.31 0 top
JP705  [1X01_SMD_3.25X0.85MM_NO_SILK]  13.23,30.04 0 top
JP706  [1X01_SMD_3.25X0.85MM_NO_SILK]  13.23,28.77 0 top
JP707  [1X01_SMD_3.25X0.85MM_NO_SILK]  13.23,27.5 0 top
JP708  [1X01_SMD_3.25X0.85MM_NO_SILK]  13.23,26.23 0 top
JP709  [1X01_SMD_3.25X0.85MM_NO_SILK]  13.23,24.96 0 top
JP710  [1X01_SMD_3.25X0.85MM_NO_SILK]  13.23,23.69 0 top
JP711  [1X01_SMD_3.25X0.85MM_NO_SILK]  13.23,22.42 0 top
JP712  [1X01_SMD_3.25X0.85MM_NO_SILK]  13.23,21.15 0 top
JP713  [1X01_SMD_3.25X0.85MM_NO_SILK]  13.23,19.88 0 top
JP714  [1X01_SMD_3.25X0.85MM_NO_SILK]  13.23,18.61 0 top
JP715  [1X01_SMD_3.25X0.85MM_NO_SILK]  13.23,17.34 0 top
JP716  [1X01_SMD_3.25X0.85MM_NO_SILK]  13.23,16.07 0 top
JP717  [1X01_SMD_3.25X0.85MM_NO_SILK]  13.23,14.8 0 top
JP718  [1X01_SMD_3.25X0.85MM_NO_SILK]  13.23,13.53 0 top
JP719  [1X01_SMD_3.25X0.85MM_NO_SILK]  13.23,12.26 0 top
JP720  [1X01_SMD_3.25X0.85MM_NO_SILK]  13.23,10.99 0 top
JP721  [1X01_SMD_3.25X0.85MM_NO_SILK]  66.76,85.92 0 top
JP722  [1X01_SMD_3.25X0.85MM_NO_SILK]  66.76,84.65 0 top
JP723  [1X01_SMD_3.25X0.85MM_NO_SILK]  66.76,83.38 0 top
JP724  [1X01_SMD_3.25X0.85MM_NO_SILK]  66.76,82.11 0 top
JP725  [1X01_SMD_3.25X0.85MM_NO_SILK]  66.76,80.84 0 top
JP726  [1X01_SMD_3.25X0.85MM_NO_SILK]  66.76,79.57 0 top
JP727  [1X01_SMD_3.25X0.85MM_NO_SILK]  66.76,78.3 0 top
JP728  [1X01_SMD_3.25X0.85MM_NO_SILK]  66.76,77.03 0 top
JP729  [1X01_SMD_3.25X0.85MM_NO_SILK]  66.76,75.76 0 top
JP730  [1X01_SMD_3.25X0.85MM_NO_SILK]  66.76,74.49 0 top
JP731  [1X01_SMD_3.25X0.85MM_NO_SILK]  66.76,73.22 0 top
JP732  [1X01_SMD_3.25X0.85MM_NO_SILK]  66.76,71.95 0 top
JP733  [1X01_SMD_3.25X0.85MM_NO_SILK]  66.76,70.68 0 top
JP734  [1X01_SMD_3.25X0.85MM_NO_SILK]  66.76,69.41 0 top
JP735  [1X01_SMD_3.25X0.85MM_NO_SILK]  66.76,68.14 0 top
JP736  [1X01_SMD_3.25X0.85MM_NO_SILK]  66.76,66.87 0 top
JP737  [1X01_SMD_3.25X0.85MM_NO_SILK]  66.76,65.6 0 top
JP738  [1X01_SMD_3.25X0.85MM_NO_SILK]  66.76,64.33 0 top
JP739  [1X01_SMD_3.25X0.85MM_NO_SILK]  66.76,63.06 0 top
JP740  [1X01_SMD_3.25X0.85MM_NO_SILK]  66.76,61.79 0 top
JP741  [1X01_SMD_3.25X0.85MM_NO_SILK]  66.76,60.52 0 top
JP742  [1X01_SMD_3.25X0.85MM_NO_SILK]  66.76,59.25 0 top
JP743  [1X01_SMD_3.25X0.85MM_NO_SILK]  66.76,57.98 0 top
JP744  [1X01_SMD_3.25X0.85MM_NO_SILK]  66.76,56.71 0 top
JP745  [1X01_SMD_3.25X0.85MM_NO_SILK]  66.76,55.44 0 top
JP746  [1X01_SMD_3.25X0.85MM_NO_SILK]  66.76,54.17 0 top
JP747  [1X01_SMD_3.25X0.85MM_NO_SILK]  66.76,52.9 0 top
JP748  [1X01_SMD_3.25X0.85MM_NO_SILK]  66.76,51.63 0 top
JP749  [1X01_SMD_3.25X0.85MM_NO_SILK]  66.76,50.36 0 top
JP750  [1X01_SMD_3.25X0.85MM_NO_SILK]  66.76,49.09 0 top
JP751  [1X01_SMD_3.25X0.85MM_NO_SILK]  66.76,47.82 0 top
JP752  [1X01_SMD_3.25X0.85MM_NO_SILK]  66.76,46.55 0 top
JP753  [1X01_SMD_3.25X0.85MM_NO_SILK]  66.76,45.28 0 top
JP754  [1X01_SMD_3.25X0.85MM_NO_SILK]  66.76,44.01 0 top
JP755  [1X01_SMD_3.25X0.85MM_NO_SILK]  66.76,42.74 0 top
JP756  [1X01_SMD_3.25X0.85MM_NO_SILK]  66.76,41.47 0 top
JP757  [1X01_SMD_3.25X0.85MM_NO_SILK]  66.76,40.2 0 top
JP758  [1X01_SMD_3.25X0.85MM_NO_SILK]  66.76,38.93 0 top
JP759  [1X01_SMD_3.25X0.85MM_NO_SILK]  66.76,37.66 0 top
JP760  [1X01_SMD_3.25X0.85MM_NO_SILK]  66.76,36.39 0 top
JP761  [1X01_SMD_3.25X0.85MM_NO_SILK]  66.76,35.12 0 top
JP762  [1X01_SMD_3.25X0.85MM_NO_SILK]  66.76,33.85 0 top
JP763  [1X01_SMD_3.25X0.85MM_NO_SILK]  66.76,32.58 0 top
JP764  [1X01_SMD_3.25X0.85MM_NO_SILK]  66.76,31.31 0 top
JP765  [1X01_SMD_3.25X0.85MM_NO_SILK]  66.76,30.04 0 top
JP766  [1X01_SMD_3.25X0.85MM_NO_SILK]  66.76,28.77 0 top
JP767  [1X01_SMD_3.25X0.85MM_NO_SILK]  66.76,27.5 0 top
JP768  [1X01_SMD_3.25X0.85MM_NO_SILK]  66.76,26.23 0 top
JP769  [1X01_SMD_3.25X0.85MM_NO_SILK]  66.76,24.96 0 top
JP770  [1X01_SMD_3.25X0.85MM_NO_SILK]  66.76,23.69 0 top
JP771  [1X01_SMD_3.25X0.85MM_NO_SILK]  66.76,22.42 0 top
JP772  [1X01_SMD_3.25X0.85MM_NO_SILK]  66.76,21.15 0 top
JP773  [1X01_SMD_3.25X0.85MM_NO_SILK]  66.76,19.88 0 top
JP774  [1X01_SMD_3.25X0.85MM_NO_SILK]  66.76,18.61 0 top
JP775  [1X01_SMD_3.25X0.85MM_NO_SILK]  66.76,17.34 0 top
JP776  [1X01_SMD_3.25X0.85MM_NO_SILK]  66.76,16.07 0 top
JP777  [1X01_SMD_3.25X0.85MM_NO_SILK]  66.76,14.8 0 top
JP778  [1X01_SMD_3.25X0.85MM_NO_SILK]  66.76,13.53 0 top
JP779  [1X01_SMD_3.25X0.85MM_NO_SILK]  66.76,12.26 0 top
JP780  [1X01_SMD_3.25X0.85MM_NO_SILK]  66.76,10.99 0 top
JP781  [1X01_SMD_3.25X0.85MM_NO_SILK]  72.03,85.92 0 top
JP782  [1X01_SMD_3.25X0.85MM_NO_SILK]  72.03,84.65 0 top
JP783  [1X01_SMD_3.25X0.85MM_NO_SILK]  72.03,83.38 0 top
JP784  [1X01_SMD_3.25X0.85MM_NO_SILK]  72.03,82.11 0 top
JP785  [1X01_SMD_3.25X0.85MM_NO_SILK]  72.03,80.84 0 top
JP786  [1X01_SMD_3.25X0.85MM_NO_SILK]  72.03,79.57 0 top
JP787  [1X01_SMD_3.25X0.85MM_NO_SILK]  72.03,78.3 0 top
JP788  [1X01_SMD_3.25X0.85MM_NO_SILK]  72.03,77.03 0 top
JP789  [1X01_SMD_3.25X0.85MM_NO_SILK]  72.03,75.76 0 top
JP790  [1X01_SMD_3.25X0.85MM_NO_SILK]  72.03,74.49 0 top
JP791  [1X01_SMD_3.25X0.85MM_NO_SILK]  72.03,73.22 0 top
JP792  [1X01_SMD_3.25X0.85MM_NO_SILK]  72.03,71.95 0 top
JP793  [1X01_SMD_3.25X0.85MM_NO_SILK]  72.03,70.68 0 top
JP794  [1X01_SMD_3.25X0.85MM_NO_SILK]  72.03,69.41 0 top
JP795  [1X01_SMD_3.25X0.85MM_NO_SILK]  72.03,68.14 0 top
JP796  [1X01_SMD_3.25X0.85MM_NO_SILK]  72.03,66.87 0 top
JP797  [1X01_SMD_3.25X0.85MM_NO_SILK]  72.03,65.6 0 top
JP798  [1X01_SMD_3.25X0.85MM_NO_SILK]  72.03,64.33 0 top
JP799  [1X01_SMD_3.25X0.85MM_NO_SILK]  72.03,63.06 0 top
JP800  [1X01_SMD_3.25X0.85MM_NO_SILK]  72.03,61.79 0 top
JP801  [1X01_SMD_3.25X0.85MM_NO_SILK]  72.03,60.52 0 top
JP802  [1X01_SMD_3.25X0.85MM_NO_SILK]  72.03,59.25 0 top
JP803  [1X01_SMD_3.25X0.85MM_NO_SILK]  72.03,57.98 0 top
JP804  [1X01_SMD_3.25X0.85MM_NO_SILK]  72.03,56.71 0 top
JP805  [1X01_SMD_3.25X0.85MM_NO_SILK]  72.03,55.44 0 top
JP806  [1X01_SMD_3.25X0.85MM_NO_SILK]  72.03,54.17 0 top
JP807  [1X01_SMD_3.25X0.85MM_NO_SILK]  72.03,52.9 0 top
JP808  [1X01_SMD_3.25X0.85MM_NO_SILK]  72.03,51.63 0 top
JP809  [1X01_SMD_3.25X0.85MM_NO_SILK]  72.03,50.36 0 top
JP810  [1X01_SMD_3.25X0.85MM_NO_SILK]  72.03,49.09 0 top
JP811  [1X01_SMD_3.25X0.85MM_NO_SILK]  72.03,47.82 0 top
JP812  [1X01_SMD_3.25X0.85MM_NO_SILK]  72.03,46.55 0 top
JP813  [1X01_SMD_3.25X0.85MM_NO_SILK]  72.03,45.28 0 top
JP814  [1X01_SMD_3.25X0.85MM_NO_SILK]  72.03,44.01 0 top
JP815  [1X01_SMD_3.25X0.85MM_NO_SILK]  72.03,42.74 0 top
JP816  [1X01_SMD_3.25X0.85MM_NO_SILK]  72.03,41.47 0 top
JP817  [1X01_SMD_3.25X0.85MM_NO_SILK]  72.03,40.2 0 top
JP818  [1X01_SMD_3.25X0.85MM_NO_SILK]  72.03,38.93 0 top
JP819  [1X01_SMD_3.25X0.85MM_NO_SILK]  72.03,37.66 0 top
JP820  [1X01_SMD_3.25X0.85MM_NO_SILK]  72.03,36.39 0 top
JP821  [1X01_SMD_3.25X0.85MM_NO_SILK]  72.03,35.12 0 top
JP822  [1X01_SMD_3.25X0.85MM_NO_SILK]  72.03,33.85 0 top
JP823  [1X01_SMD_3.25X0.85MM_NO_SILK]  72.03,32.58 0 top
JP824  [1X01_SMD_3.25X0.85MM_NO_SILK]  72.03,31.31 0 top
JP825  [1X01_SMD_3.25X0.85MM_NO_SILK]  72.03,30.04 0 top
JP826  [1X01_SMD_3.25X0.85MM_NO_SILK]  72.03,28.77 0 top
JP827  [1X01_SMD_3.25X0.85MM_NO_SILK]  72.03,27.5 0 top
JP828  [1X01_SMD_3.25X0.85MM_NO_SILK]  72.03,26.23 0 top
JP829  [1X01_SMD_3.25X0.85MM_NO_SILK]  72.03,24.96 0 top
JP830  [1X01_SMD_3.25X0.85MM_NO_SILK]  72.03,23.69 0 top
JP831  [1X01_SMD_3.25X0.85MM_NO_SILK]  72.03,22.42 0 top
JP832  [1X01_SMD_3.25X0.85MM_NO_SILK]  72.03,21.15 0 top
JP833  [1X01_SMD_3.25X0.85MM_NO_SILK]  72.03,19.88 0 top
JP834  [1X01_SMD_3.25X0.85MM_NO_SILK]  72.03,18.61 0 top
JP835  [1X01_SMD_3.25X0.85MM_NO_SILK]  72.03,17.34 0 top
JP836  [1X01_SMD_3.25X0.85MM_NO_SILK]  72.03,16.07 0 top
JP837  [1X01_SMD_3.25X0.85MM_NO_SILK]  72.03,14.8 0 top
JP838  [1X01_SMD_3.25X0.85MM_NO_SILK]  72.03,13.53 0 top
JP839  [1X01_SMD_3.25X0.85MM_NO_SILK]  72.03,12.26 0 top
JP840  [1X01_SMD_3.25X0.85MM_NO_SILK]  72.03,10.99 0 top
JP841  [1X01_SMD_3.25X0.85MM_NO_SILK]  24.32,95.2 90 top
JP842  [1X01_SMD_3.25X0.85MM_NO_SILK]  25.59,95.2 90 top
JP843  [1X01_SMD_3.25X0.85MM_NO_SILK]  26.86,95.2 90 top
JP844  [1X01_SMD_3.25X0.85MM_NO_SILK]  28.13,95.2 90 top
JP845  [1X01_SMD_3.25X0.85MM_NO_SILK]  29.4,95.2 90 top
JP846  [1X01_SMD_3.25X0.85MM_NO_SILK]  30.67,95.2 90 top
JP847  [1X01_SMD_3.25X0.85MM_NO_SILK]  31.94,95.2 90 top
JP848  [1X01_SMD_3.25X0.85MM_NO_SILK]  33.21,95.2 90 top
JP849  [1X01_SMD_3.25X0.85MM_NO_SILK]  34.48,95.2 90 top
JP850  [1X01_SMD_3.25X0.85MM_NO_SILK]  35.75,95.2 90 top
JP851  [1X01_SMD_3.25X0.85MM_NO_SILK]  24.32,91.01 90 top
JP852  [1X01_SMD_3.25X0.85MM_NO_SILK]  25.59,91.01 90 top
JP853  [1X01_SMD_3.25X0.85MM_NO_SILK]  26.86,91.01 90 top
JP854  [1X01_SMD_3.25X0.85MM_NO_SILK]  28.13,91.01 90 top
JP855  [1X01_SMD_3.25X0.85MM_NO_SILK]  29.4,91.01 90 top
JP856  [1X01_SMD_3.25X0.85MM_NO_SILK]  30.67,91.01 90 top
JP857  [1X01_SMD_3.25X0.85MM_NO_SILK]  31.94,91.01 90 top
JP858  [1X01_SMD_3.25X0.85MM_NO_SILK]  33.21,91.01 90 top
JP859  [1X01_SMD_3.25X0.85MM_NO_SILK]  34.48,91.01 90 top
JP860  [1X01_SMD_3.25X0.85MM_NO_SILK]  35.75,91.01 90 top
JP861  [1X01_SMD_3.25X0.85MM_NO_SILK]  44.76,95.2 90 top
JP862  [1X01_SMD_3.25X0.85MM_NO_SILK]  46.03,95.2 90 top
JP863  [1X01_SMD_3.25X0.85MM_NO_SILK]  47.3,95.2 90 top
JP864  [1X01_SMD_3.25X0.85MM_NO_SILK]  48.57,95.2 90 top
JP865  [1X01_SMD_3.25X0.85MM_NO_SILK]  49.84,95.2 90 top
JP866  [1X01_SMD_3.25X0.85MM_NO_SILK]  51.11,95.2 90 top
JP867  [1X01_SMD_3.25X0.85MM_NO_SILK]  52.38,95.2 90 top
JP868  [1X01_SMD_3.25X0.85MM_NO_SILK]  53.65,95.2 90 top
JP869  [1X01_SMD_3.25X0.85MM_NO_SILK]  54.92,95.2 90 top
JP870  [1X01_SMD_3.25X0.85MM_NO_SILK]  56.19,95.2 90 top
JP871  [1X01_SMD_3.25X0.85MM_NO_SILK]  44.76,91.01 90 top
JP872  [1X01_SMD_3.25X0.85MM_NO_SILK]  46.03,91.01 90 top
JP873  [1X01_SMD_3.25X0.85MM_NO_SILK]  47.3,91.01 90 top
JP874  [1X01_SMD_3.25X0.85MM_NO_SILK]  48.57,91.01 90 top
JP875  [1X01_SMD_3.25X0.85MM_NO_SILK]  49.84,91.01 90 top
JP876  [1X01_SMD_3.25X0.85MM_NO_SILK]  51.11,91.01 90 top
JP877  [1X01_SMD_3.25X0.85MM_NO_SILK]  52.38,91.01 90 top
JP878  [1X01_SMD_3.25X0.85MM_NO_SILK]  53.65,91.01 90 top
JP879  [1X01_SMD_3.25X0.85MM_NO_SILK]  54.92,91.01 90 top
JP880  [1X01_SMD_3.25X0.85MM_NO_SILK]  56.19,91.01 90 top
JP881  [1X01_SMD_3.25X0.85MM_NO_SILK]  24.32,5.92 90 top
JP882  [1X01_SMD_3.25X0.85MM_NO_SILK]  25.59,5.92 90 top
JP883  [1X01_SMD_3.25X0.85MM_NO_SILK]  26.86,5.92 90 top
JP884  [1X01_SMD_3.25X0.85MM_NO_SILK]  28.13,5.92 90 top
JP885  [1X01_SMD_3.25X0.85MM_NO_SILK]  29.4,5.92 90 top
JP886  [1X01_SMD_3.25X0.85MM_NO_SILK]  30.67,5.92 90 top
JP887  [1X01_SMD_3.25X0.85MM_NO_SILK]  31.94,5.92 90 top
JP888  [1X01_SMD_3.25X0.85MM_NO_SILK]  33.21,5.92 90 top
JP889  [1X01_SMD_3.25X0.85MM_NO_SILK]  34.48,5.92 90 top
JP890  [1X01_SMD_3.25X0.85MM_NO_SILK]  35.75,5.92 90 top
JP891  [1X01_SMD_3.25X0.85MM_NO_SILK]  44.64,5.92 90 top
JP892  [1X01_SMD_3.25X0.85MM_NO_SILK]  45.91,5.92 90 top
JP893  [1X01_SMD_3.25X0.85MM_NO_SILK]  47.18,5.92 90 top
JP894  [1X01_SMD_3.25X0.85MM_NO_SILK]  48.45,5.92 90 top
JP895  [1X01_SMD_3.25X0.85MM_NO_SILK]  49.72,5.92 90 top
JP896  [1X01_SMD_3.25X0.85MM_NO_SILK]  50.99,5.92 90 top
JP897  [1X01_SMD_3.25X0.85MM_NO_SILK]  52.26,5.92 90 top
JP898  [1X01_SMD_3.25X0.85MM_NO_SILK]  53.53,5.92 90 top
JP899  [1X01_SMD_3.25X0.85MM_NO_SILK]  54.8,5.92 90 top
JP900  [1X01_SMD_3.25X0.85MM_NO_SILK]  56.07,5.92 90 top
JP901  [1X01_SMD_3.25X0.85MM_NO_SILK]  7.96,85.92 0 bottom
JP902  [1X01_SMD_3.25X0.85MM_NO_SILK]  7.96,84.65 0 bottom
JP903  [1X01_SMD_3.25X0.85MM_NO_SILK]  7.96,83.38 0 bottom
JP904  [1X01_SMD_3.25X0.85MM_NO_SILK]  7.96,82.11 0 bottom
JP905  [1X01_SMD_3.25X0.85MM_NO_SILK]  7.96,80.84 0 bottom
JP906  [1X01_SMD_3.25X0.85MM_NO_SILK]  7.96,79.57 0 bottom
JP907  [1X01_SMD_3.25X0.85MM_NO_SILK]  7.96,78.3 0 bottom
JP908  [1X01_SMD_3.25X0.85MM_NO_SILK]  7.96,77.03 0 bottom
JP909  [1X01_SMD_3.25X0.85MM_NO_SILK]  7.96,75.76 0 bottom
JP910  [1X01_SMD_3.25X0.85MM_NO_SILK]  7.96,74.49 0 bottom
JP911  [1X01_SMD_3.25X0.85MM_NO_SILK]  7.96,73.22 0 bottom
JP912  [1X01_SMD_3.25X0.85MM_NO_SILK]  7.96,71.95 0 bottom
JP913  [1X01_SMD_3.25X0.85MM_NO_SILK]  7.96,70.68 0 bottom
JP914  [1X01_SMD_3.25X0.85MM_NO_SILK]  7.96,69.41 0 bottom
JP915  [1X01_SMD_3.25X0.85MM_NO_SILK]  7.96,68.14 0 bottom
JP916  [1X01_SMD_3.25X0.85MM_NO_SILK]  7.96,66.87 0 bottom
JP917  [1X01_SMD_3.25X0.85MM_NO_SILK]  7.96,65.6 0 bottom
JP918  [1X01_SMD_3.25X0.85MM_NO_SILK]  7.96,64.33 0 bottom
JP919  [1X01_SMD_3.25X0.85MM_NO_SILK]  7.96,63.06 0 bottom
JP920  [1X01_SMD_3.25X0.85MM_NO_SILK]  7.96,61.79 0 bottom
JP921  [1X01_SMD_3.25X0.85MM_NO_SILK]  7.96,60.52 0 bottom
JP922  [1X01_SMD_3.25X0.85MM_NO_SILK]  7.96,59.25 0 bottom
JP923  [1X01_SMD_3.25X0.85MM_NO_SILK]  7.96,57.98 0 bottom
JP924  [1X01_SMD_3.25X0.85MM_NO_SILK]  7.96,56.71 0 bottom
JP925  [1X01_SMD_3.25X0.85MM_NO_SILK]  7.96,55.44 0 bottom
JP926  [1X01_SMD_3.25X0.85MM_NO_SILK]  7.96,54.17 0 bottom
JP927  [1X01_SMD_3.25X0.85MM_NO_SILK]  7.96,52.9 0 bottom
JP928  [1X01_SMD_3.25X0.85MM_NO_SILK]  7.96,51.63 0 bottom
JP929  [1X01_SMD_3.25X0.85MM_NO_SILK]  7.96,50.36 0 bottom
JP930  [1X01_SMD_3.25X0.85MM_NO_SILK]  7.96,49.09 0 bottom
JP931  [1X01_SMD_3.25X0.85MM_NO_SILK]  7.96,47.82 0 bottom
JP932  [1X01_SMD_3.25X0.85MM_NO_SILK]  7.96,46.55 0 bottom
JP933  [1X01_SMD_3.25X0.85MM_NO_SILK]  7.96,45.28 0 bottom
JP934  [1X01_SMD_3.25X0.85MM_NO_SILK]  7.96,44.01 0 bottom
JP935  [1X01_SMD_3.25X0.85MM_NO_SILK]  7.96,42.74 0 bottom
JP936  [1X01_SMD_3.25X0.85MM_NO_SILK]  7.96,41.47 0 bottom
JP937  [1X01_SMD_3.25X0.85MM_NO_SILK]  7.96,40.2 0 bottom
JP938  [1X01_SMD_3.25X0.85MM_NO_SILK]  7.96,38.93 0 bottom
JP939  [1X01_SMD_3.25X0.85MM_NO_SILK]  7.96,37.66 0 bottom
JP940  [1X01_SMD_3.25X0.85MM_NO_SILK]  7.96,36.39 0 bottom
JP941  [1X01_SMD_3.25X0.85MM_NO_SILK]  7.96,35.12 0 bottom
JP942  [1X01_SMD_3.25X0.85MM_NO_SILK]  7.96,33.85 0 bottom
JP943  [1X01_SMD_3.25X0.85MM_NO_SILK]  7.96,32.58 0 bottom
JP944  [1X01_SMD_3.25X0.85MM_NO_SILK]  7.96,31.31 0 bottom
JP945  [1X01_SMD_3.25X0.85MM_NO_SILK]  7.96,30.04 0 bottom
JP946  [1X01_SMD_3.25X0.85MM_NO_SILK]  7.96,28.77 0 bottom
JP947  [1X01_SMD_3.25X0.85MM_NO_SILK]  7.96,27.5 0 bottom
JP948  [1X01_SMD_3.25X0.85MM_NO_SILK]  7.96,26.23 0 bottom
JP949  [1X01_SMD_3.25X0.85MM_NO_SILK]  7.96,24.96 0 bottom
JP950  [1X01_SMD_3.25X0.85MM_NO_SILK]  7.96,23.69 0 bottom
JP951  [1X01_SMD_3.25X0.85MM_NO_SILK]  7.96,22.42 0 bottom
JP952  [1X01_SMD_3.25X0.85MM_NO_SILK]  7.96,21.15 0 bottom
JP953  [1X01_SMD_3.25X0.85MM_NO_SILK]  7.96,19.88 0 bottom
JP954  [1X01_SMD_3.25X0.85MM_NO_SILK]  7.96,18.61 0 bottom
JP955  [1X01_SMD_3.25X0.85MM_NO_SILK]  7.96,17.34 0 bottom
JP956  [1X01_SMD_3.25X0.85MM_NO_SILK]  7.96,16.07 0 bottom
JP957  [1X01_SMD_3.25X0.85MM_NO_SILK]  7.96,14.8 0 bottom
JP958  [1X01_SMD_3.25X0.85MM_NO_SILK]  7.96,13.53 0 bottom
JP959  [1X01_SMD_3.25X0.85MM_NO_SILK]  7.96,12.26 0 bottom
JP960  [1X01_SMD_3.25X0.85MM_NO_SILK]  7.96,10.99 0 bottom
JP961  [1X01_SMD_3.25X0.85MM_NO_SILK]  13.23,85.92 0 bottom
JP962  [1X01_SMD_3.25X0.85MM_NO_SILK]  13.23,84.65 0 bottom
JP963  [1X01_SMD_3.25X0.85MM_NO_SILK]  13.23,83.38 0 bottom
JP964  [1X01_SMD_3.25X0.85MM_NO_SILK]  13.23,82.11 0 bottom
JP965  [1X01_SMD_3.25X0.85MM_NO_SILK]  13.23,80.84 0 bottom
JP966  [1X01_SMD_3.25X0.85MM_NO_SILK]  13.23,79.57 0 bottom
JP967  [1X01_SMD_3.25X0.85MM_NO_SILK]  13.23,78.3 0 bottom
JP968  [1X01_SMD_3.25X0.85MM_NO_SILK]  13.23,77.03 0 bottom
JP969  [1X01_SMD_3.25X0.85MM_NO_SILK]  13.23,75.76 0 bottom
JP970  [1X01_SMD_3.25X0.85MM_NO_SILK]  13.23,74.49 0 bottom
JP971  [1X01_SMD_3.25X0.85MM_NO_SILK]  13.23,73.22 0 bottom
JP972  [1X01_SMD_3.25X0.85MM_NO_SILK]  13.23,71.95 0 bottom
JP973  [1X01_SMD_3.25X0.85MM_NO_SILK]  13.23,70.68 0 bottom
JP974  [1X01_SMD_3.25X0.85MM_NO_SILK]  13.23,69.41 0 bottom
JP975  [1X01_SMD_3.25X0.85MM_NO_SILK]  13.23,68.14 0 bottom
JP976  [1X01_SMD_3.25X0.85MM_NO_SILK]  13.23,66.87 0 bottom
JP977  [1X01_SMD_3.25X0.85MM_NO_SILK]  13.23,65.6 0 bottom
JP978  [1X01_SMD_3.25X0.85MM_NO_SILK]  13.23,64.33 0 bottom
JP979  [1X01_SMD_3.25X0.85MM_NO_SILK]  13.23,63.06 0 bottom
JP980  [1X01_SMD_3.25X0.85MM_NO_SILK]  13.23,61.79 0 bottom
JP981  [1X01_SMD_3.25X0.85MM_NO_SILK]  13.23,60.52 0 bottom
JP982  [1X01_SMD_3.25X0.85MM_NO_SILK]  13.23,59.25 0 bottom
JP983  [1X01_SMD_3.25X0.85MM_NO_SILK]  13.23,57.98 0 bottom
JP984  [1X01_SMD_3.25X0.85MM_NO_SILK]  13.23,56.71 0 bottom
JP985  [1X01_SMD_3.25X0.85MM_NO_SILK]  13.23,55.44 0 bottom
JP986  [1X01_SMD_3.25X0.85MM_NO_SILK]  13.23,54.17 0 bottom
JP987  [1X01_SMD_3.25X0.85MM_NO_SILK]  13.23,52.9 0 bottom
JP988  [1X01_SMD_3.25X0.85MM_NO_SILK]  13.23,51.63 0 bottom
JP989  [1X01_SMD_3.25X0.85MM_NO_SILK]  13.23,50.36 0 bottom
JP990  [1X01_SMD_3.25X0.85MM_NO_SILK]  13.23,49.09 0 bottom
JP991  [1X01_SMD_3.25X0.85MM_NO_SILK]  13.23,47.82 0 bottom
JP992  [1X01_SMD_3.25X0.85MM_NO_SILK]  13.23,46.55 0 bottom
JP993  [1X01_SMD_3.25X0.85MM_NO_SILK]  13.23,45.28 0 bottom
JP994  [1X01_SMD_3.25X0.85MM_NO_SILK]  13.23,44.01 0 bottom
JP995  [1X01_SMD_3.25X0.85MM_NO_SILK]  13.23,42.74 0 bottom
JP996  [1X01_SMD_3.25X0.85MM_NO_SILK]  13.23,41.47 0 bottom
JP997  [1X01_SMD_3.25X0.85MM_NO_SILK]  13.23,40.2 0 bottom
JP998  [1X01_SMD_3.25X0.85MM_NO_SILK]  13.23,38.93 0 bottom
JP999  [1X01_SMD_3.25X0.85MM_NO_SILK]  13.23,37.66 0 bottom
JP1000  [1X01_SMD_3.25X0.85MM_NO_SILK]  13.23,36.39 0 bottom
JP1001  [1X01_SMD_3.25X0.85MM_NO_SILK]  13.23,35.12 0 bottom
JP1002  [1X01_SMD_3.25X0.85MM_NO_SILK]  13.23,33.85 0 bottom
JP1003  [1X01_SMD_3.25X0.85MM_NO_SILK]  13.23,32.58 0 bottom
JP1004  [1X01_SMD_3.25X0.85MM_NO_SILK]  13.23,31.31 0 bottom
JP1005  [1X01_SMD_3.25X0.85MM_NO_SILK]  13.23,30.04 0 bottom
JP1006  [1X01_SMD_3.25X0.85MM_NO_SILK]  13.23,28.77 0 bottom
JP1007  [1X01_SMD_3.25X0.85MM_NO_SILK]  13.23,27.5 0 bottom
JP1008  [1X01_SMD_3.25X0.85MM_NO_SILK]  13.23,26.23 0 bottom
JP1009  [1X01_SMD_3.25X0.85MM_NO_SILK]  13.23,24.96 0 bottom
JP1010  [1X01_SMD_3.25X0.85MM_NO_SILK]  13.23,23.69 0 bottom
JP1011  [1X01_SMD_3.25X0.85MM_NO_SILK]  13.23,22.42 0 bottom
JP1012  [1X01_SMD_3.25X0.85MM_NO_SILK]  13.23,21.15 0 bottom
JP1013  [1X01_SMD_3.25X0.85MM_NO_SILK]  13.23,19.88 0 bottom
JP1014  [1X01_SMD_3.25X0.85MM_NO_SILK]  13.23,18.61 0 bottom
JP1015  [1X01_SMD_3.25X0.85MM_NO_SILK]  13.23,17.34 0 bottom
JP1016  [1X01_SMD_3.25X0.85MM_NO_SILK]  13.23,16.07 0 bottom
JP1017  [1X01_SMD_3.25X0.85MM_NO_SILK]  13.23,14.8 0 bottom
JP1018  [1X01_SMD_3.25X0.85MM_NO_SILK]  13.23,13.53 0 bottom
JP1019  [1X01_SMD_3.25X0.85MM_NO_SILK]  13.23,12.26 0 bottom
JP1020  [1X01_SMD_3.25X0.85MM_NO_SILK]  13.23,10.99 0 bottom
JP1021  [1X01_SMD_3.25X0.85MM_NO_SILK]  66.76,85.92 0 bottom
JP1022  [1X01_SMD_3.25X0.85MM_NO_SILK]  66.76,84.65 0 bottom
JP1023  [1X01_SMD_3.25X0.85MM_NO_SILK]  66.76,83.38 0 bottom
JP1024  [1X01_SMD_3.25X0.85MM_NO_SILK]  66.76,82.11 0 bottom
JP1025  [1X01_SMD_3.25X0.85MM_NO_SILK]  66.76,80.84 0 bottom
JP1026  [1X01_SMD_3.25X0.85MM_NO_SILK]  66.76,79.57 0 bottom
JP1027  [1X01_SMD_3.25X0.85MM_NO_SILK]  66.76,78.3 0 bottom
JP1028  [1X01_SMD_3.25X0.85MM_NO_SILK]  66.76,77.03 0 bottom
JP1029  [1X01_SMD_3.25X0.85MM_NO_SILK]  66.76,75.76 0 bottom
JP1030  [1X01_SMD_3.25X0.85MM_NO_SILK]  66.76,74.49 0 bottom
JP1031  [1X01_SMD_3.25X0.85MM_NO_SILK]  66.76,73.22 0 bottom
JP1032  [1X01_SMD_3.25X0.85MM_NO_SILK]  66.76,71.95 0 bottom
JP1033  [1X01_SMD_3.25X0.85MM_NO_SILK]  66.76,70.68 0 bottom
JP1034  [1X01_SMD_3.25X0.85MM_NO_SILK]  66.76,69.41 0 bottom
JP1035  [1X01_SMD_3.25X0.85MM_NO_SILK]  66.76,68.14 0 bottom
JP1036  [1X01_SMD_3.25X0.85MM_NO_SILK]  66.76,66.87 0 bottom
JP1037  [1X01_SMD_3.25X0.85MM_NO_SILK]  66.76,65.6 0 bottom
JP1038  [1X01_SMD_3.25X0.85MM_NO_SILK]  66.76,64.33 0 bottom
JP1039  [1X01_SMD_3.25X0.85MM_NO_SILK]  66.76,63.06 0 bottom
JP1040  [1X01_SMD_3.25X0.85MM_NO_SILK]  66.76,61.79 0 bottom
JP1041  [1X01_SMD_3.25X0.85MM_NO_SILK]  66.76,60.52 0 bottom
JP1042  [1X01_SMD_3.25X0.85MM_NO_SILK]  66.76,59.25 0 bottom
JP1043  [1X01_SMD_3.25X0.85MM_NO_SILK]  66.76,57.98 0 bottom
JP1044  [1X01_SMD_3.25X0.85MM_NO_SILK]  66.76,56.71 0 bottom
JP1045  [1X01_SMD_3.25X0.85MM_NO_SILK]  66.76,55.44 0 bottom
JP1046  [1X01_SMD_3.25X0.85MM_NO_SILK]  66.76,54.17 0 bottom
JP1047  [1X01_SMD_3.25X0.85MM_NO_SILK]  66.76,52.9 0 bottom
JP1048  [1X01_SMD_3.25X0.85MM_NO_SILK]  66.76,51.63 0 bottom
JP1049  [1X01_SMD_3.25X0.85MM_NO_SILK]  66.76,50.36 0 bottom
JP1050  [1X01_SMD_3.25X0.85MM_NO_SILK]  66.76,49.09 0 bottom
JP1051  [1X01_SMD_3.25X0.85MM_NO_SILK]  66.76,47.82 0 bottom
JP1052  [1X01_SMD_3.25X0.85MM_NO_SILK]  66.76,46.55 0 bottom
JP1053  [1X01_SMD_3.25X0.85MM_NO_SILK]  66.76,45.28 0 bottom
JP1054  [1X01_SMD_3.25X0.85MM_NO_SILK]  66.76,44.01 0 bottom
JP1055  [1X01_SMD_3.25X0.85MM_NO_SILK]  66.76,42.74 0 bottom
JP1056  [1X01_SMD_3.25X0.85MM_NO_SILK]  66.76,41.47 0 bottom
JP1057  [1X01_SMD_3.25X0.85MM_NO_SILK]  66.76,40.2 0 bottom
JP1058  [1X01_SMD_3.25X0.85MM_NO_SILK]  66.76,38.93 0 bottom
JP1059  [1X01_SMD_3.25X0.85MM_NO_SILK]  66.76,37.66 0 bottom
JP1060  [1X01_SMD_3.25X0.85MM_NO_SILK]  66.76,36.39 0 bottom
JP1061  [1X01_SMD_3.25X0.85MM_NO_SILK]  66.76,35.12 0 bottom
JP1062  [1X01_SMD_3.25X0.85MM_NO_SILK]  66.76,33.85 0 bottom
JP1063  [1X01_SMD_3.25X0.85MM_NO_SILK]  66.76,32.58 0 bottom
JP1064  [1X01_SMD_3.25X0.85MM_NO_SILK]  66.76,31.31 0 bottom
JP1065  [1X01_SMD_3.25X0.85MM_NO_SILK]  66.76,30.04 0 bottom
JP1066  [1X01_SMD_3.25X0.85MM_NO_SILK]  66.76,28.77 0 bottom
JP1067  [1X01_SMD_3.25X0.85MM_NO_SILK]  66.76,27.5 0 bottom
JP1068  [1X01_SMD_3.25X0.85MM_NO_SILK]  66.76,26.23 0 bottom
JP1069  [1X01_SMD_3.25X0.85MM_NO_SILK]  66.76,24.96 0 bottom
JP1070  [1X01_SMD_3.25X0.85MM_NO_SILK]  66.76,23.69 0 bottom
JP1071  [1X01_SMD_3.25X0.85MM_NO_SILK]  66.76,22.42 0 bottom
JP1072  [1X01_SMD_3.25X0.85MM_NO_SILK]  66.76,21.15 0 bottom
JP1073  [1X01_SMD_3.25X0.85MM_NO_SILK]  66.76,19.88 0 bottom
JP1074  [1X01_SMD_3.25X0.85MM_NO_SILK]  66.76,18.61 0 bottom
JP1075  [1X01_SMD_3.25X0.85MM_NO_SILK]  66.76,17.34 0 bottom
JP1076  [1X01_SMD_3.25X0.85MM_NO_SILK]  66.76,16.07 0 bottom
JP1077  [1X01_SMD_3.25X0.85MM_NO_SILK]  66.76,14.8 0 bottom
JP1078  [1X01_SMD_3.25X0.85MM_NO_SILK]  66.76,13.53 0 bottom
JP1079  [1X01_SMD_3.25X0.85MM_NO_SILK]  66.76,12.26 0 bottom
JP1080  [1X01_SMD_3.25X0.85MM_NO_SILK]  66.76,10.99 0 bottom
JP1081  [1X01_SMD_3.25X0.85MM_NO_SILK]  72.03,85.92 0 bottom
JP1082  [1X01_SMD_3.25X0.85MM_NO_SILK]  72.03,84.65 0 bottom
JP1083  [1X01_SMD_3.25X0.85MM_NO_SILK]  72.03,83.38 0 bottom
JP1084  [1X01_SMD_3.25X0.85MM_NO_SILK]  72.03,82.11 0 bottom
JP1085  [1X01_SMD_3.25X0.85MM_NO_SILK]  72.03,80.84 0 bottom
JP1086  [1X01_SMD_3.25X0.85MM_NO_SILK]  72.03,79.57 0 bottom
JP1087  [1X01_SMD_3.25X0.85MM_NO_SILK]  72.03,78.3 0 bottom
JP1088  [1X01_SMD_3.25X0.85MM_NO_SILK]  72.03,77.03 0 bottom
JP1089  [1X01_SMD_3.25X0.85MM_NO_SILK]  72.03,75.76 0 bottom
JP1090  [1X01_SMD_3.25X0.85MM_NO_SILK]  72.03,74.49 0 bottom
JP1091  [1X01_SMD_3.25X0.85MM_NO_SILK]  72.03,73.22 0 bottom
JP1092  [1X01_SMD_3.25X0.85MM_NO_SILK]  72.03,71.95 0 bottom
JP1093  [1X01_SMD_3.25X0.85MM_NO_SILK]  72.03,70.68 0 bottom
JP1094  [1X01_SMD_3.25X0.85MM_NO_SILK]  72.03,69.41 0 bottom
JP1095  [1X01_SMD_3.25X0.85MM_NO_SILK]  72.03,68.14 0 bottom
JP1096  [1X01_SMD_3.25X0.85MM_NO_SILK]  72.03,66.87 0 bottom
JP1097  [1X01_SMD_3.25X0.85MM_NO_SILK]  72.03,65.6 0 bottom
JP1098  [1X01_SMD_3.25X0.85MM_NO_SILK]  72.03,64.33 0 bottom
JP1099  [1X01_SMD_3.25X0.85MM_NO_SILK]  72.03,63.06 0 bottom
JP1100  [1X01_SMD_3.25X0.85MM_NO_SILK]  72.03,61.79 0 bottom
JP1101  [1X01_SMD_3.25X0.85MM_NO_SILK]  72.03,60.52 0 bottom
JP1102  [1X01_SMD_3.25X0.85MM_NO_SILK]  72.03,59.25 0 bottom
JP1103  [1X01_SMD_3.25X0.85MM_NO_SILK]  72.03,57.98 0 bottom
JP1104  [1X01_SMD_3.25X0.85MM_NO_SILK]  72.03,56.71 0 bottom
JP1105  [1X01_SMD_3.25X0.85MM_NO_SILK]  72.03,55.44 0 bottom
JP1106  [1X01_SMD_3.25X0.85MM_NO_SILK]  72.03,54.17 0 bottom
JP1107  [1X01_SMD_3.25X0.85MM_NO_SILK]  72.03,52.9 0 bottom
JP1108  [1X01_SMD_3.25X0.85MM_NO_SILK]  72.03,51.63 0 bottom
JP1109  [1X01_SMD_3.25X0.85MM_NO_SILK]  72.03,50.36 0 bottom
JP1110  [1X01_SMD_3.25X0.85MM_NO_SILK]  72.03,49.09 0 bottom
JP1111  [1X01_SMD_3.25X0.85MM_NO_SILK]  72.03,47.82 0 bottom
JP1112  [1X01_SMD_3.25X0.85MM_NO_SILK]  72.03,46.55 0 bottom
JP1113  [1X01_SMD_3.25X0.85MM_NO_SILK]  72.03,45.28 0 bottom
JP1114  [1X01_SMD_3.25X0.85MM_NO_SILK]  72.03,44.01 0 bottom
JP1115  [1X01_SMD_3.25X0.85MM_NO_SILK]  72.03,42.74 0 bottom
JP1116  [1X01_SMD_3.25X0.85MM_NO_SILK]  72.03,41.47 0 bottom
JP1117  [1X01_SMD_3.25X0.85MM_NO_SILK]  72.03,40.2 0 bottom
JP1118  [1X01_SMD_3.25X0.85MM_NO_SILK]  72.03,38.93 0 bottom
JP1119  [1X01_SMD_3.25X0.85MM_NO_SILK]  72.03,37.66 0 bottom
JP1120  [1X01_SMD_3.25X0.85MM_NO_SILK]  72.03,36.39 0 bottom
JP1121  [1X01_SMD_3.25X0.85MM_NO_SILK]  72.03,35.12 0 bottom
JP1122  [1X01_SMD_3.25X0.85MM_NO_SILK]  72.03,33.85 0 bottom
JP1123  [1X01_SMD_3.25X0.85MM_NO_SILK]  72.03,32.58 0 bottom
JP1124  [1X01_SMD_3.25X0.85MM_NO_SILK]  72.03,31.31 0 bottom
JP1125  [1X01_SMD_3.25X0.85MM_NO_SILK]  72.03,30.04 0 bottom
JP1126  [1X01_SMD_3.25X0.85MM_NO_SILK]  72.03,28.77 0 bottom
JP1127  [1X01_SMD_3.25X0.85MM_NO_SILK]  72.03,27.5 0 bottom
JP1128  [1X01_SMD_3.25X0.85MM_NO_SILK]  72.03,26.23 0 bottom
JP1129  [1X01_SMD_3.25X0.85MM_NO_SILK]  72.03,24.96 0 bottom
JP1130  [1X01_SMD_3.25X0.85MM_NO_SILK]  72.03,23.69 0 bottom
JP1131  [1X01_SMD_3.25X0.85MM_NO_SILK]  72.03,22.42 0 bottom
JP1132  [1X01_SMD_3.25X0.85MM_NO_SILK]  72.03,21.15 0 bottom
JP1133  [1X01_SMD_3.25X0.85MM_NO_SILK]  72.03,19.88 0 bottom
JP1134  [1X01_SMD_3.25X0.85MM_NO_SILK]  72.03,18.61 0 bottom
JP1135  [1X01_SMD_3.25X0.85MM_NO_SILK]  72.03,17.34 0 bottom
JP1136  [1X01_SMD_3.25X0.85MM_NO_SILK]  72.03,16.07 0 bottom
JP1137  [1X01_SMD_3.25X0.85MM_NO_SILK]  72.03,14.8 0 bottom
JP1138  [1X01_SMD_3.25X0.85MM_NO_SILK]  72.03,13.53 0 bottom
JP1139  [1X01_SMD_3.25X0.85MM_NO_SILK]  72.03,12.26 0 bottom
JP1140  [1X01_SMD_3.25X0.85MM_NO_SILK]  72.03,10.99 0 bottom
JP1141  [1X01_SMD_3.25X0.85MM_NO_SILK]  24.32,95.2 270 bottom